# Altium project Archim_0.4.PrjPcb (part 2 of 3)

## Sheet EndStops.SchDoc: Endstops
size Letter; DocumentNumber: 7; SheetNumber: 4; SheetTotal: 11
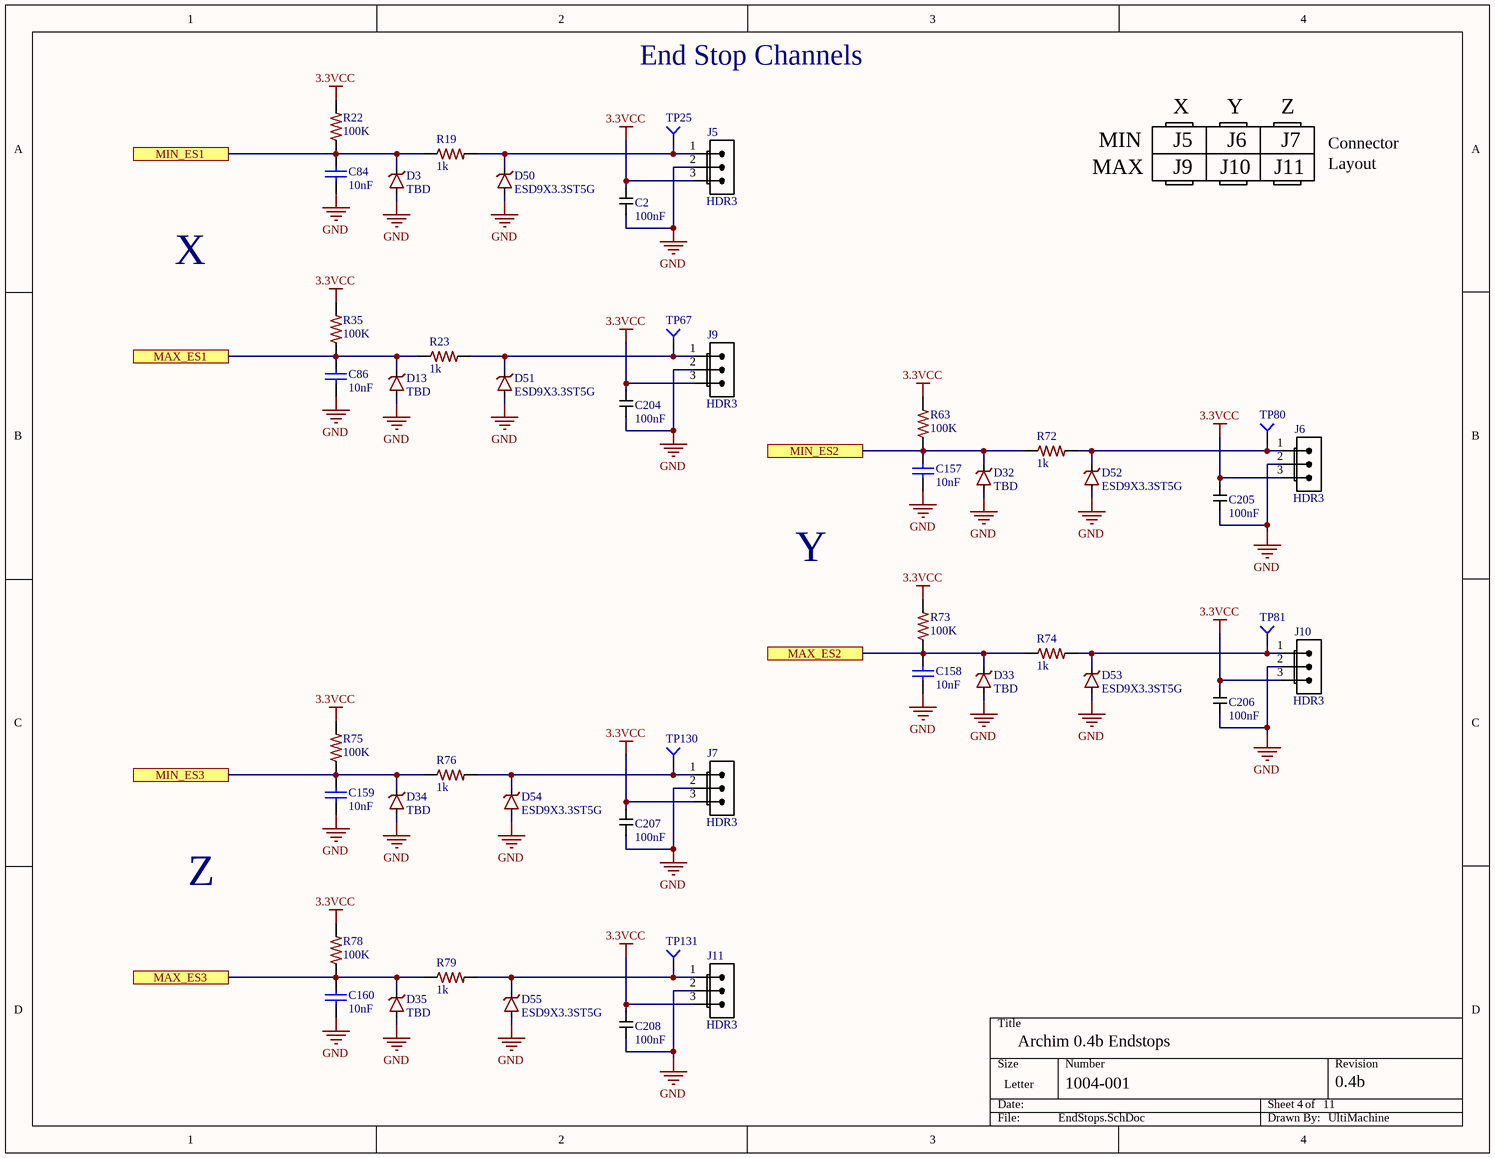
[diagram p3: EndStops.SchDoc]

### Parts
C2  100nF  [C0201 Large Pads]
C84  10nF  [C0402]
C86  10nF  [C0402]
C157  10nF  [C0402]
C158  10nF  [C0402]
C159  10nF  [C0402]
C160  10nF  [C0402]
C204  100nF  [C0201 Large Pads]
C205  100nF  [C0201 Large Pads]
C206  100nF  [C0201 Large Pads]
C207  100nF  [C0201 Large Pads]
C208  100nF  [C0201 Large Pads]
D3  TBD  [SOD923-D]
D13  TBD  [SOD923-D]
D32  TBD  [SOD923-D]
D33  TBD  [SOD923-D]
D34  TBD  [SOD923-D]
D35  TBD  [SOD923-D]
D50  ESD9X3.3ST5G  [SOD923-D]
D51  ESD9X3.3ST5G  [SOD923-D]
D52  ESD9X3.3ST5G  [SOD923-D]
D53  ESD9X3.3ST5G  [SOD923-D]
D54  ESD9X3.3ST5G  [SOD923-D]
D55  ESD9X3.3ST5G  [SOD923-D]
J5  value HDR3  [70543-02 PIN-IN-PASTE]  (hidden comment: Molex 70543-03)
J6  value HDR3  [70543-02 PIN-IN-PASTE]  (hidden comment: Molex 70543-03)
J7  value HDR3  [70543-02 PIN-IN-PASTE]  (hidden comment: Molex 70543-03)
J9  value HDR3  [70543-02 PIN-IN-PASTE]  (hidden comment: Molex 70543-03)
J10  value HDR3  [70543-02 PIN-IN-PASTE]  (hidden comment: Molex 70543-03)
J11  value HDR3  [70543-02 PIN-IN-PASTE]  (hidden comment: Molex 70543-03)
R19  1k  [R0402]
R22  100K  [R0402]
R23  1k  [R0402]
R35  100K  [R0402]
R63  100K  [R0402]
R72  1k  [R0402]
R73  100K  [R0402]
R74  1k  [R0402]
R75  100K  [R0402]
R76  1k  [R0402]
R78  100K  [R0402]
R79  1k  [R0402]
TP25  TP4  [TP-2]  (value not drawn)  (no BOM)
TP67  TP4  [TP-2]  (value not drawn)  (no BOM)
TP80  TP4  [TP-2]  (value not drawn)  (no BOM)
TP81  TP4  [TP-2]  (value not drawn)  (no BOM)
TP130  TP4  [TP-2]  (value not drawn)  (no BOM)
TP131  TP4  [TP-2]  (value not drawn)  (no BOM)

### Ports
MAX_ES1, MAX_ES2, MAX_ES3, MIN_ES1, MIN_ES2, MIN_ES3

### Nets
3.3VCC: C2.2 C204.2 C205.2 C206.2 C207.2 C208.2 J5.3(S) J6.3(S) J7.3(S) J9.3(S) J10.3(S) J11.3(S) R22.2 R35.2 R63.2 R73.2 R75.2 R78.2
GND: C2.1 C84.2 C86.2 C157.2 C158.2 C159.2 C160.2 C204.1 C205.1 C206.1 C207.1 C208.1 D3.A D13.A D32.A D33.A D34.A D35.A D50.A D51.A D52.A D53.A D54.A D55.A J5.2(S) J6.2(S) J7.2(S) J9.2(S) J10.2(S) J11.2(S)
MAX_ES1: C86.1 D13.K R23.1 R35.1 ; port MAX_ES1
MAX_ES2: C158.1 D33.K R73.1 R74.1 ; port MAX_ES2
MAX_ES3: C160.1 D35.K R78.1 R79.1 ; port MAX_ES3
MIN_ES1: C84.1 D3.K R19.1 R22.1 ; port MIN_ES1
MIN_ES2: C157.1 D32.K R63.1 R72.1 ; port MIN_ES2
MIN_ES3: C159.1 D34.K R75.1 R76.1 ; port MIN_ES3
NetD50_K: D50.K J5.1(S) R19.2 TP25.1
NetD51_K: D51.K J9.1(S) R23.2 TP67.1
NetD52_K: D52.K J6.1(S) R72.2 TP80.1
NetD53_K: D53.K J10.1(S) R74.2 TP81.1
NetD54_K: D54.K J7.1(S) R76.2 TP130.1
NetD55_K: D55.K J11.1(S) R79.2 TP131.1

### Notes on the sheet
- End Stop Channels
- MIN
- X
- J5
- Y
- J6
- Z
- J7
- Connector
- MAX
- J9
- J10
- J11
- Layout

### Library data of the parts
C2 C204-C208 = 100nF 6.3V X5R 0201: CAP CER 0.1UF 6.3V 10% X5R 0201; PART: .1uF; MANUFACTURER: Samsung; MANUFACTURER #: CL03A104KQ3NNNC; DISTRIBUTOR: DIGI-KEY; DISTRIBUTOR #: 1276-1013-1-ND; TOLERANCE: 10%; VOLTAGE: 6.3V
C84 C86 C157-C160 = GRM155R71H103JA88D: CAP CER 10nF 50V X7R 0402; PART DESCRIPTION: 10000pF ±5% 50V Ceramic Capacitor X7R 0402 (1005 Metric); MANUFACTURER: Murata; TOLERANCE: 5%; VALUE: 10nF; EE_SPEC: 50V; MANUFACTURER #: GRM155R71H103JA88D; DISTRIBUTOR #: 490-7763-1-ND; DISTRIBUTOR: Digi-Key Electronics; PART: 10nF 50V X7R 0402
D3 D13 D32-D35 = SOD923_TBD: MANUFACTURER #: TBD; VALUE: TBD; EE_SPEC: TBD
D50-D55 = ESD9X3.3ST5G: TVS DIODE 3.3VWM 10.4VC SOD923; MANUFACTURER: On Semi; PART DESCRIPTION: TVS DIODE 3.3VWM SOD923; TOLERANCE: -NA-; VALUE: 3.3V; EE_SPEC: 3.3Vso 15pF; MANUFACTURER #: ESD9X3.3ST5G; DISTRIBUTOR #: ESD9X3.3ST5GOSCT-ND; DISTRIBUTOR: Digikey
J5-J7 J9-J11 = CONN 3POS VERT 0.1" SHRD LOCKING PIP: 3 Positions Header, Shrouded Connector 0.100" (2.54mm) Through Hole Gold - Pin in Paste; MANUFACTURER #: 0705430002; PART: 3 Pin Conn VERT; TOLERANCE: -NA-; MANUFACTURER: Molex; DISTRIBUTOR #: WM4801-ND; DISTRIBUTOR: Digikey; PART DESCRIPTION: 3 Positions Header, Shrouded Connector 0.100" (2.54mm) Through Hole Gold; EE_SPEC: -NA-
R19 R23 R72 R74 R76 R79 = RK73H1ETTP1001F: RES 0402 1k 63mW 1%; MANUFACTURER: Yageo; MANUFACTURER #: RC0402FR-071KL; PART: 1k 1% 0402; PART DESCRIPTION: 1k Ohm ±1% 0.063W, 1/16W Chip Resistor 0402 (1005 Metric) Moisture Resistant Thick Film; EE_SPEC: 1/16W; VALUE: 1k; DISTRIBUTOR #: 311-1.00KLRTR-ND; DISTRIBUTOR: Digi-Key Electronics; TOLERANCE: 1%
R22 R35 R63 R73 R75 R78 = RC1005F104CS: RES SMD 100K OHM 1% 1/16W 0402; MANUFACTURER: Samsung; PART: 100k 1% 0402; PART DESCRIPTION: 100k Ohm ±1% 0.063W, 1/16W Chip Resistor 0402 (1005 Metric) Moisture Resistant Thick Film; VALUE: 100K; MANUFACTURER #: RC1005F104CS; DISTRIBUTOR #: 1276-3432-1-ND; DISTRIBUTOR: Digi-Key Electronics; TOLERANCE: 1%; EE_SPEC: 1/16W
TP25 TP67 TP80 TP81 TP130 TP131 = Socket: MANUFACTURER #: NOTAPART-Testpoint

## Sheet Motor-X.SchDoc: Motor-X
size Letter; DocumentNumber: 3; SheetNumber: 5; SheetTotal: 11
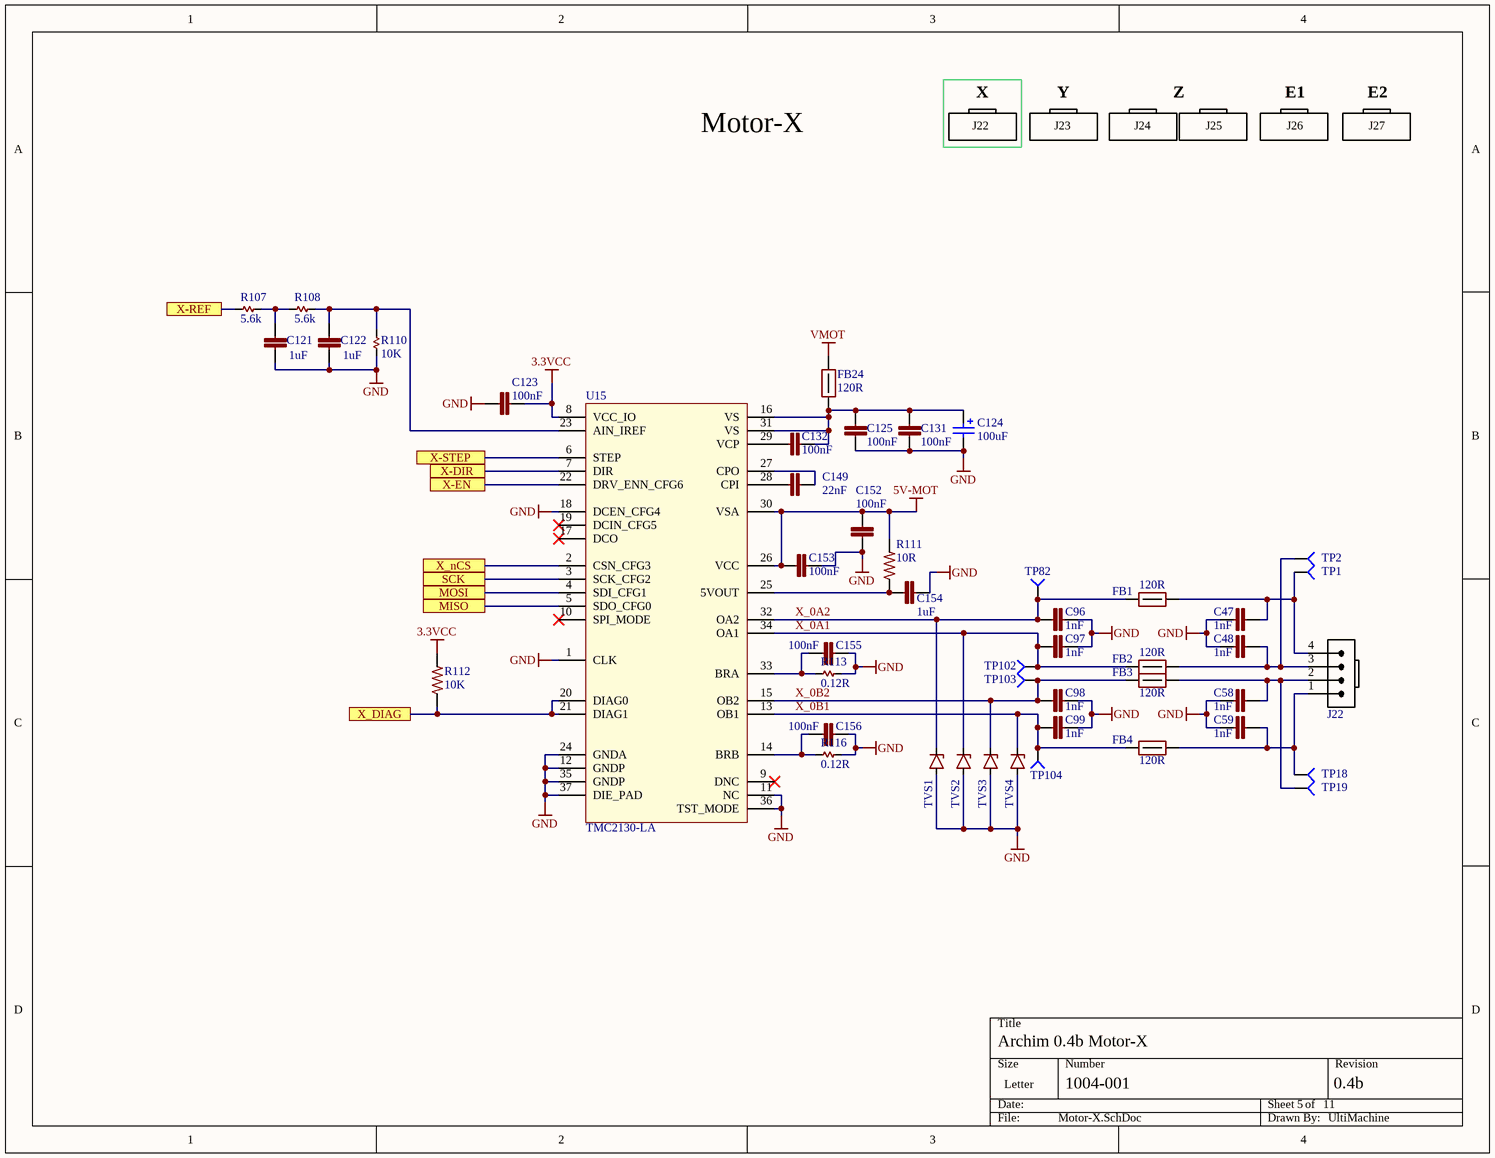
[diagram p4: Motor-X.SchDoc]

### Parts
C47  1nF  [C0402]
C48  1nF  [C0402]
C58  1nF  [C0402]
C59  1nF  [C0402]
C96  1nF  [C0402]
C97  1nF  [C0402]
C98  1nF  [C0402]
C99  1nF  [C0402]
C121  1uF  [C0402]
C122  1uF  [C0402]
C123  100nF  [C0402]
C124  value 100uF  [CAP-ELEC-063063077]  (hidden comment: UWT1V101MCL1GS)
C125  100nF  [C0603]
C131  100nF  [C0603]
C132  100nF  [C0603]
C149  22nF  [C0402]
C152  100nF  [C0402]
C153  100nF  [C0402]
C154  1uF  [C0402]
C155  100nF  [C0603]
C156  100nF  [C0603]
FB1  120R  [FB0603]
FB2  120R  [FB0603]
FB3  120R  [FB0603]
FB4  120R  [FB0603]
FB24  120R  [FB0603]
J22  Molex 0705430038  [4POL254 PIN-IN-PASTE]  (value not drawn)
R107  5.6k  [R0402]
R108  5.6k  [R0402]
R110  10K  [R0402]
R111  10R  [R0402]
R112  10K  [R0402]
R113  0.12R  [R1206]
R116  0.12R  [R1206]
TP1  TP4  [TP-2]  (value not drawn)  (no BOM)
TP2  TP4  [TP-2]  (value not drawn)  (no BOM)
TP18  TP4  [TP-2]  (value not drawn)  (no BOM)
TP19  TP4  [TP-2]  (value not drawn)  (no BOM)
TP82  TP4  [TP-2]  (value not drawn)  (no BOM)
TP102  TP4  [TP-2]  (value not drawn)  (no BOM)
TP103  TP4  [TP-2]  (value not drawn)  (no BOM)
TP104  TP4  [TP-2]  (value not drawn)  (no BOM)
TVS1  TVS 30V SMF  [SMF]  (value not drawn)
TVS2  TVS 30V SMF  [SMF]  (value not drawn)
TVS3  TVS 30V SMF  [SMF]  (value not drawn)
TVS4  TVS 30V SMF  [SMF]  (value not drawn)
U15  TMC2130-LA  [QFN36-50P500X600X900_HS-37N]

### Ports
MISO, MOSI, SCK, X-DIR, X-EN, X-REF, X-STEP, X_DIAG, X_nCS

### Nets
3.3VCC: C123.1 R112.2 U15.8(VCC_IO)
5V-MOT: C152.2 C153.2 R111.2 U15.26(VCC) U15.30(VSA)
GND: C47.1 C48.1 C58.1 C59.1 C96.2 C97.2 C98.2 C99.2 C121.2 C122.2 C123.2 C124.2 C125.1 C131.1 C152.1 C153.1 C154.2 C155.1 C156.1 R110.1 R113.2 R116.2 TVS1.A TVS2.A TVS3.A TVS4.A U15.1(CLK) U15.11(NC) U15.12(GNDP) U15.18(DCEN_CFG4) U15.24(GNDA) U15.35(GNDP) U15.36(TST_MODE) U15.37(DIE_PAD)
VMOT: FB24.2
MISO: U15.5(SDO_CFG0) ; port MISO
MOSI: U15.4(SDI_CFG1) ; port MOSI
SCK: U15.3(SCK_CFG2) ; port SCK
X-DIR: U15.7(DIR) ; port X-DIR
X-EN: U15.22(DRV_ENN_CFG6) ; port X-EN
X-REF: R107.1 ; port X-REF
X-STEP: U15.6(STEP) ; port X-STEP
X_0A1: C97.1 FB2.1 TP102.1 TVS2.K U15.34(OA1)
X_0A2: C96.1 FB1.1 TP82.1 TVS1.K U15.32(OA2)
X_0B1: C99.1 FB4.1 TP104.1 TVS4.K U15.13(OB1)
X_0B2: C98.1 FB3.1 TP103.1 TVS3.K U15.15(OB2)
X_DIAG: R112.1 U15.20(DIAG0) U15.21(DIAG1) ; port X_DIAG
X_nCS: U15.2(CSN_CFG3) ; port X_nCS
NetC47_2: C47.2 FB1.2 J22.4 TP1.1
NetC48_2: C48.2 FB2.2 J22.3 TP2.1
NetC58_2: C58.2 FB3.2 J22.2 TP19.1
NetC59_2: C59.2 FB4.2 J22.1 TP18.1
NetC121_1: C121.1 R107.2 R108.1
NetC122_1: C122.1 R108.2 R110.2 U15.23(AIN_IREF)
NetC124_1: C124.1 C125.2 C131.2 C132.2 FB24.1 U15.16(VS) U15.31(VS)
NetC132_1: C132.1 U15.29(VCP)
NetC149_1: C149.1 U15.28(CPI)
NetC149_2: C149.2 U15.27(CPO)
NetC154_1: C154.1 R111.1 U15.25(5VOUT)
NetC155_2: C155.2 R113.1 U15.33(BRA)
NetC156_2: C156.2 R116.1 U15.14(BRB)

Not connected (* = marked no-connect by the designer): U15 9(DNC)* 10(SPI_MODE)* 17(DCO)* 19(DCIN_CFG5)*

### Notes on the sheet
- X
- Y
- Z
- E1
- E2
- Motor-X
- J22
- J23
- J24
- J25
- J26
- J27

### Library data of the parts
C47 C48 C58 C59 C96-C99 = CAP 1nF 50V 0402 X7R: as C13 on sheet Power; VALUE: 1nF; DISTRIBUTOR #: 490-1303-2-ND; DISTRIBUTOR: Digi-Key Electronics; EE_SPEC: 50V
C121 C122 = GRM155R60J105KE19D: as C24 on sheet Power; VALUE: 1uF; MANUFACTURER #: GRM155R60J105KE19D; DISTRIBUTOR #: 490-1320-2-ND; DISTRIBUTOR: Digi-Key Electronics; TOLERANCE: 10%; EE_SPEC: 1uF 6.3V X5R 0402
C123 C152 C153 = GRM155R71C104KA88D: CAP CER 0402 100nF 16V 10% X7R; Manufacturer: Murata; PART: 0.1uF 16V X7R 0402; Part Description: 0.10µF ±10% 16V Ceramic Capacitor X7R 0402 (1005 Metric); EE_SPEC: 100nF 16V X7R 0402; VALUE: 100nF; MANUFACTURER #: GRM155R71C104KA88D; DISTRIBUTOR #: 490-3261-2-ND; DISTRIBUTOR: Digi-Key Electronics; Tolerance: 10%
C124 = UWT1V101MCL1GS: CAP ALUM 100UF 35V 20% SMD; Manufacturer: Nichicon; PART: 100uF 35V SMD Al-El; Part Description: 100µF 35V Aluminum Capacitors Radial, Can - SMD 1000 Hrs @ 105°C; EE_SPEC: 100uF 35V Al-El; MANUFACTURER #: UWT1V101MCL1GS; DISTRIBUTOR #: 493-2203-2-ND; DISTRIBUTOR: Digi-Key Electronics; Tolerance: 20%
C125 C131 C132 C155 C156 = C0603C104K5RACTU: as C199 on sheet Power; VALUE: 100nF; MANUFACTURER #: C0603C104K5RACTU; DISTRIBUTOR #: 399-5089-2-ND; DISTRIBUTOR: Digi-Key Electronics; PART: 100nF 50V X7R 0603; Tolerance: 10%
C149 = GCM155R71H223KA55D: CAP CER 0402 22nF ±10% 50V X7R; Manufacturer: YAGEO; Part Description: 0.022µF ±10% 50V Ceramic Capacitor X7R 0402 (1005 Metric); EE_SPEC: 22nF 50V X7R 0402; Tolerance: +/- 10%; VALUE: 22nF; MANUFACTURER #: GCM155R71H223KA55D; DISTRIBUTOR #: 490-4763-2-ND; DISTRIBUTOR: Digi-Key Electronics; PART: 22nF
C154 = GRM155R60J105KE19D: CAP CER 0402 1uF 6.3V 10% X5R; Manufacturer: Murata; Part Description: 1µF ±10% 6.3V Ceramic Capacitor X5R 0402 (1005 Metric); EE_SPEC: 1uF 6.3V X5R 0402; VALUE: 1uF; MANUFACTURER #: GRM155R60J105KE19D; DISTRIBUTOR #: 490-1320-2-ND; DISTRIBUTOR: Digi-Key Electronics; PART: 1uF 6.3V X5R 0402; Tolerance: 10%
FB1-FB4 = FERRITE 120R 3A 0603: as FB26 on sheet Microcontroller; DISTRIBUTOR #: 1276-6351-2-ND; DISTRIBUTOR: Digi-Key Electronics; PART: FERRITE 120R 3A 0603; PART DESCRIPTION: FERRITE BEAD 120 OHM 0603 1LN
FB24 = FERRITE 120R 3A 0603: FERRITE BEAD 120 OHM 0603 1LN; MANUFACTURER: Samsung; MANUFACTURER #: CIS10P121AC; VALUE: 120Rfb; TOLERANCE: -NA-; EE_SPEC: 3A; DISTRIBUTOR #: 1276-6351-2-ND; DISTRIBUTOR: Digi-Key Electronics; PART: FERRITE 120R 3A 0603; PART DESCRIPTION: FERRITE BEAD 120 OHM 0603 1LN
J22 = Molex 0705430003 PIP: as J21 on sheet Power
R107 R108 = 5.6k 1% 0402: RES SMD 5.6K OHM 1% 1/16W 0402; MANUFACTURER: YAGEO; MANUFACTURER #: RC0402FR-075K6L; PART DESCRIPTION: ±1% 0.063W, 1/16W Chip Resistor 0402 (1005 Metric) Moisture Resistant Thick Film; DISTRIBUTOR #: 311-5.6KLRTR-ND; DISTRIBUTOR: Digi-Key Electronics; PART: RES SMD 5.6K OHM 1% 1/16W 0402; TOLERANCE: 1%; EE_SPEC: 1/16W; VALUE: 5.6k
R110 = 10k 1% 0402: as R11 on sheet Power; DISTRIBUTOR #: YAG1249TR-ND; DISTRIBUTOR: Digi-Key Electronics; PART: 10k 1% 0402; TOLERANCE: 1%; EE_SPEC: 1/16W; VALUE: 10K
R111 = RC0402FR-0710RL: RES SMD 10 OHM 1% 1/16W 0402; Manufacturer: Yageo; Part Description: 10 Ohm ±1% 0.063W, 1/16W Chip Resistor 0402 (1005 Metric) Moisture Resistant Thick Film; EE_SPEC: 10R 1% 0402; VALUE: 10R; MANUFACTURER #: RC0402FR-0710RL; DISTRIBUTOR #: 311-10.0LRTR-ND; DISTRIBUTOR: Digi-Key Electronics; PART: 10R; Tolerance: 1%
R112 = RC0402FR-0710KP: as R64 on sheet Microcontroller; VALUE: 10K; MANUFACTURER #: RC0402FR-0710KP; DISTRIBUTOR #: YAG1249TR-ND; DISTRIBUTOR: Digi-Key Electronics; TOLERANCE: 1%; EE_SPEC: 1/16W
R113 R116 = 0.12R 1% 1206: RES 0.12 OHM 1% 1/2W 1206; MANUFACTURER #: RL1206FR-7W0R12L; Part Description: 120 mOhms ±1% 0.5W, 1/2W Chip Resistor 1206 (3216 Metric) Automotive AEC-Q200, Current Sense, Moisture Resistant Thick Film; Tolerance: +/- 1%; DISTRIBUTOR #: 311-.12LYTR-ND; DISTRIBUTOR: Digi-Key; EE_SPEC: 0.12R 1% 1206; PART: 0.12R; VALUE: 0.12R
TP1 TP2 TP18 TP19 TP82 TP102-TP104 = Socket: MANUFACTURER #: NOTAPART-Testpoint
TVS1-TVS4 = TVS 30V SMF: TVS DIODE 30VWM 48.4VC SMF; MANUFACTURER: Vishay; MANUFACTURER #: SMF30A-E3-08; PART: TVS Diode 48.4VC; TOLERANCE: -NA-; EE_SPEC: 30Vrs 48.4Vc; DISTRIBUTOR #: SMF30A-E3-08GITR-ND; DISTRIBUTOR: Digi-Key Electronics; PART DESCRIPTION: TVS DIODE 30VWM 48.4VC SMF
U15 = TMC2130-LA-T: IC STEPPER MOTOR DVR SPI 36QFN; Manufacturer: Trinamic; Part Description: Bipolar Motor Driver Power MOSFET SPI, Step/Direction 36-QFN (5x6); EE_SPEC: 46V 1.2A 1/256 Step; Tolerance: NA; DISTRIBUTOR #: 1460-1130-2-ND; DISTRIBUTOR: Digi-Key Electronics; MANUFACTURER #: TMC2130-LA-T; PART: TMC2130; VALUE: TMC2130

## Sheet Motor-Y.SchDoc: Motor-Y
size Letter; DocumentNumber: 3; SheetNumber: 6; SheetTotal: 11
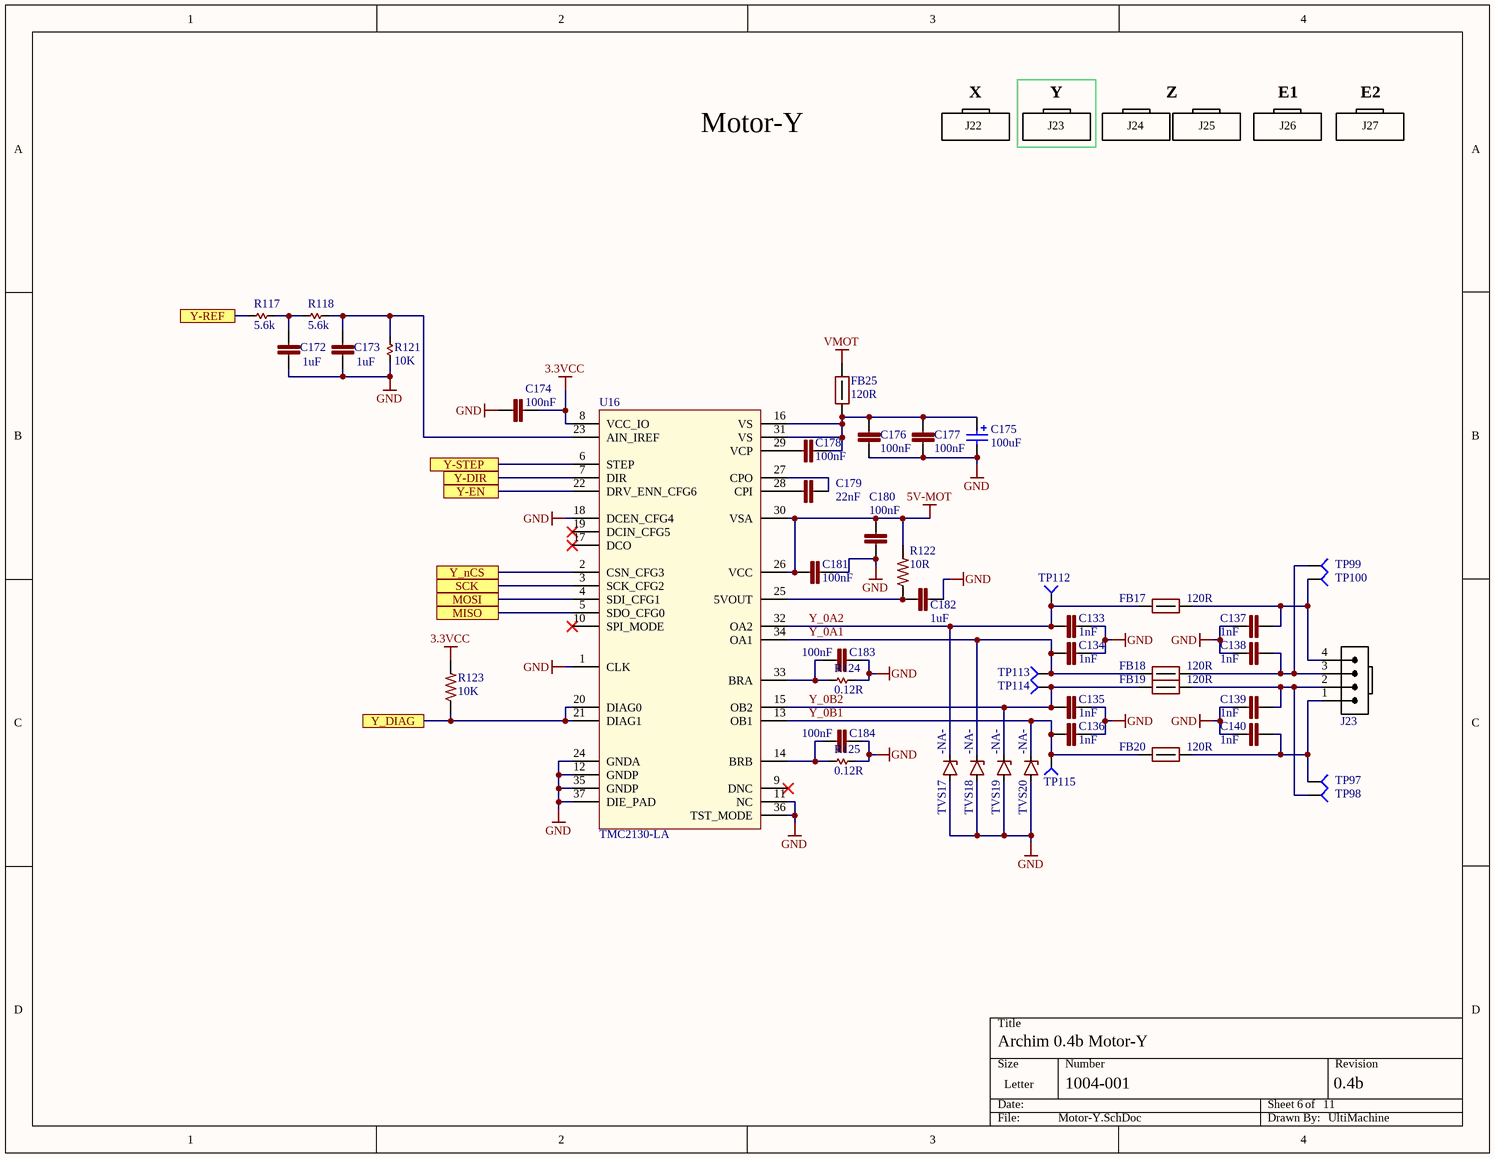
[diagram p5: Motor-Y.SchDoc]

### Parts
C133  1nF  [C0402]
C134  1nF  [C0402]
C135  1nF  [C0402]
C136  1nF  [C0402]
C137  1nF  [C0402]
C138  1nF  [C0402]
C139  1nF  [C0402]
C140  1nF  [C0402]
C172  1uF  [C0402]
C173  1uF  [C0402]
C174  100nF  [C0402]
C175  value 100uF  [CAP-ELEC-063063077]  (hidden comment: UWT1V101MCL1GS)
C176  100nF  [C0603]
C177  100nF  [C0603]
C178  100nF  [C0603]
C179  22nF  [C0402]
C180  100nF  [C0402]
C181  100nF  [C0402]
C182  1uF  [C0402]
C183  100nF  [C0603]
C184  100nF  [C0603]
FB17  120R  [FB0603]
FB18  120R  [FB0603]
FB19  120R  [FB0603]
FB20  120R  [FB0603]
FB25  120R  [FB0603]
J23  Molex 0705430038  [4POL254 PIN-IN-PASTE]  (value not drawn)
R117  5.6k  [R0402]
R118  5.6k  [R0402]
R121  10K  [R0402]
R122  10R  [R0402]
R123  10K  [R0402]
R124  0.12R  [R1206]
R125  0.12R  [R1206]
TP97  TP4  [TP-2]  (value not drawn)  (no BOM)
TP98  TP4  [TP-2]  (value not drawn)  (no BOM)
TP99  TP4  [TP-2]  (value not drawn)  (no BOM)
TP100  TP4  [TP-2]  (value not drawn)  (no BOM)
TP112  TP4  [TP-2]  (value not drawn)  (no BOM)
TP113  TP4  [TP-2]  (value not drawn)  (no BOM)
TP114  TP4  [TP-2]  (value not drawn)  (no BOM)
TP115  TP4  [TP-2]  (value not drawn)  (no BOM)
TVS17  value -NA-  [SMF]  (hidden comment: TVS 30V SMF)
TVS18  value -NA-  [SMF]  (hidden comment: TVS 30V SMF)
TVS19  value -NA-  [SMF]  (hidden comment: TVS 30V SMF)
TVS20  value -NA-  [SMF]  (hidden comment: TVS 30V SMF)
U16  TMC2130-LA  [QFN36-50P500X600X900_HS-37N]

### Ports
MISO, MOSI, SCK, Y-DIR, Y-EN, Y-REF, Y-STEP, Y_DIAG, Y_nCS

### Nets
3.3VCC: C174.1 R123.2 U16.8(VCC_IO)
5V-MOT: C180.2 C181.2 R122.2 U16.26(VCC) U16.30(VSA)
GND: C133.2 C134.2 C135.2 C136.2 C137.2 C138.2 C139.2 C140.2 C172.2 C173.2 C174.2 C175.2 C176.1 C177.1 C180.1 C181.1 C182.2 C183.1 C184.1 R121.1 R124.2 R125.2 TVS17.A TVS18.A TVS19.A TVS20.A U16.1(CLK) U16.11(NC) U16.12(GNDP) U16.18(DCEN_CFG4) U16.24(GNDA) U16.35(GNDP) U16.36(TST_MODE) U16.37(DIE_PAD)
VMOT: FB25.2
MISO: U16.5(SDO_CFG0) ; port MISO
MOSI: U16.4(SDI_CFG1) ; port MOSI
SCK: U16.3(SCK_CFG2) ; port SCK
Y-DIR: U16.7(DIR) ; port Y-DIR
Y-EN: U16.22(DRV_ENN_CFG6) ; port Y-EN
Y-REF: R117.1 ; port Y-REF
Y-STEP: U16.6(STEP) ; port Y-STEP
Y_0A1: C134.1 FB18.1 TP113.1 TVS18.K U16.34(OA1)
Y_0A2: C133.1 FB17.1 TP112.1 TVS17.K U16.32(OA2)
Y_0B1: C136.1 FB20.1 TP115.1 TVS20.K U16.13(OB1)
Y_0B2: C135.1 FB19.1 TP114.1 TVS19.K U16.15(OB2)
Y_DIAG: R123.1 U16.20(DIAG0) U16.21(DIAG1) ; port Y_DIAG
Y_nCS: U16.2(CSN_CFG3) ; port Y_nCS
NetC137_1: C137.1 FB17.2 J23.4 TP100.1
NetC138_1: C138.1 FB18.2 J23.3 TP99.1
NetC139_1: C139.1 FB19.2 J23.2 TP98.1
NetC140_1: C140.1 FB20.2 J23.1 TP97.1
NetC172_1: C172.1 R117.2 R118.1
NetC173_1: C173.1 R118.2 R121.2 U16.23(AIN_IREF)
NetC175_1: C175.1 C176.2 C177.2 C178.2 FB25.1 U16.16(VS) U16.31(VS)
NetC178_1: C178.1 U16.29(VCP)
NetC179_1: C179.1 U16.28(CPI)
NetC179_2: C179.2 U16.27(CPO)
NetC182_1: C182.1 R122.1 U16.25(5VOUT)
NetC183_2: C183.2 R124.1 U16.33(BRA)
NetC184_2: C184.2 R125.1 U16.14(BRB)

Not connected (* = marked no-connect by the designer): U16 9(DNC)* 10(SPI_MODE)* 17(DCO)* 19(DCIN_CFG5)*

### Notes on the sheet
- X
- Y
- Z
- E1
- E2
- Motor-Y
- J22
- J23
- J24
- J25
- J26
- J27

### Library data of the parts
C133-C140 = CAP 1nF 50V 0402 X7R: 1000pF 50V Ceramic Capacitor X7R 0402 (1005 Metric) 0.039" L x 0.020" W (1.00mm x 0.50mm); MANUFACTURER: Murata; MANUFACTURER #: GRM155R71H102KA01D; PART: 1nF 50V X7R 0402; PART DESCRIPTION: 1000pF ±10% 50V Ceramic Capacitor X7R 0402 (1005 Metric); TOLERANCE: 10%; VALUE: 1nF; DISTRIBUTOR #: 490-1303-2-ND; DISTRIBUTOR: Digi-Key Electronics; EE_SPEC: 50V
C172 C173 = GRM155R60J105KE19D: CAP CER 0402 1uF 6.3V 10% X5R; MANUFACTURER: Murata; PART: 1uF 6.3V X5R 0402; PART DESCRIPTION: 1µF ±10% 6.3V Ceramic Capacitor X5R 0402 (1005 Metric); VALUE: 1uF; MANUFACTURER #: GRM155R60J105KE19D; DISTRIBUTOR #: 490-1320-2-ND; DISTRIBUTOR: Digi-Key Electronics; TOLERANCE: 10%; EE_SPEC: 1uF 6.3V X5R 0402
C174 C180 C181 = GRM155R71C104KA88D: CAP CER 0402 100nF 16V 10% X7R; Manufacturer: Murata; PART: 0.1uF 16V X7R 0402; Part Description: 0.10µF ±10% 16V Ceramic Capacitor X7R 0402 (1005 Metric); EE_SPEC: 100nF 16V X7R 0402; VALUE: 100nF; MANUFACTURER #: GRM155R71C104KA88D; DISTRIBUTOR #: 490-3261-2-ND; DISTRIBUTOR: Digi-Key Electronics; Tolerance: 10%
C175 = UWT1V101MCL1GS: CAP ALUM 100UF 35V 20% SMD; Manufacturer: Nichicon; PART: 100uF 35V SMD Al-El; Part Description: 100µF 35V Aluminum Capacitors Radial, Can - SMD 1000 Hrs @ 105°C; EE_SPEC: 100uF 35V Al-El; MANUFACTURER #: UWT1V101MCL1GS; DISTRIBUTOR #: 493-2203-2-ND; DISTRIBUTOR: Digi-Key Electronics; Tolerance: 20%
C176-C178 C183 C184 = C0603C104K5RACTU: CAP CER 0603 100nF 50V 10% X7R; Manufacturer: Kemet; Part Description: 0.1µF ±10% 50V Ceramic Capacitor X7R 0603 (1608 Metric); EE_SPEC: 100nF 50V X7R 0603; VALUE: 100nF; MANUFACTURER #: C0603C104K5RACTU; DISTRIBUTOR #: 399-5089-2-ND; DISTRIBUTOR: Digi-Key Electronics; PART: 100nF 50V X7R 0603; Tolerance: 10%
C179 = GCM155R71H223KA55D: CAP CER 0402 22nF ±10% 50V X7R; Manufacturer: YAGEO; Part Description: 0.022µF ±10% 50V Ceramic Capacitor X7R 0402 (1005 Metric); EE_SPEC: 22nF 50V X7R 0402; Tolerance: +/- 10%; VALUE: 22nF; MANUFACTURER #: GCM155R71H223KA55D; DISTRIBUTOR #: 490-4763-2-ND; DISTRIBUTOR: Digi-Key Electronics; PART: 22nF
C182 = GRM155R60J105KE19D: CAP CER 0402 1uF 6.3V 10% X5R; Manufacturer: Murata; Part Description: 1µF ±10% 6.3V Ceramic Capacitor X5R 0402 (1005 Metric); EE_SPEC: 1uF 6.3V X5R 0402; VALUE: 1uF; MANUFACTURER #: GRM155R60J105KE19D; DISTRIBUTOR #: 490-1320-2-ND; DISTRIBUTOR: Digi-Key Electronics; PART: 1uF 6.3V X5R 0402; Tolerance: 10%
FB17-FB20 = FERRITE 120R 3A 0603: FERRITE BEAD 120 OHM 0603 1LN; MANUFACTURER: Samsung; MANUFACTURER #: CIS10P121AC; MANUFACTURER2#: 490-5254-2-ND; VALUE: 120Rfb; TOLERANCE: -NA-; EE_SPEC: 3A; DISTRIBUTOR #: 1276-6351-2-ND; DISTRIBUTOR: Digi-Key Electronics; PART: FERRITE 120R 3A 0603; PART DESCRIPTION: FERRITE BEAD 120 OHM 0603 1LN
FB25 = FERRITE 120R 3A 0603: FERRITE BEAD 120 OHM 0603 1LN; MANUFACTURER: Samsung; MANUFACTURER #: CIS10P121AC; VALUE: 120Rfb; TOLERANCE: -NA-; EE_SPEC: 3A; DISTRIBUTOR #: 1276-6351-2-ND; DISTRIBUTOR: Digi-Key Electronics; PART: FERRITE 120R 3A 0603; PART DESCRIPTION: FERRITE BEAD 120 OHM 0603 1LN
J23 = Molex 0705430003 PIP: Molex 4 Pin Clip Connector - Pin In Paste footprint
R117 R118 = 5.6k 1% 0402: RES SMD 5.6K OHM 1% 1/16W 0402; MANUFACTURER: YAGEO; MANUFACTURER #: RC0402FR-075K6L; PART DESCRIPTION: ±1% 0.063W, 1/16W Chip Resistor 0402 (1005 Metric) Moisture Resistant Thick Film; DISTRIBUTOR #: 311-5.6KLRTR-ND; DISTRIBUTOR: Digi-Key Electronics; PART: RES SMD 5.6K OHM 1% 1/16W 0402; TOLERANCE: 1%; EE_SPEC: 1/16W; VALUE: 5.6k
R121 = 10k 1% 0402: RES SMD 10K OHM 1% 1/16W 0402; MANUFACTURER: Yageo; MANUFACTURER #: RC0402FR-0710KP; PART DESCRIPTION: 10k Ohm ±1% 0.063W, 1/16W Chip Resistor 0402 (1005 Metric) Moisture Resistant Thick Film; DISTRIBUTOR #: YAG1249TR-ND; DISTRIBUTOR: Digi-Key Electronics; PART: 10k 1% 0402; TOLERANCE: 1%; EE_SPEC: 1/16W; VALUE: 10K
R122 = RC0402FR-0710RL: RES SMD 10 OHM 1% 1/16W 0402; Manufacturer: Yageo; Part Description: 10 Ohm ±1% 0.063W, 1/16W Chip Resistor 0402 (1005 Metric) Moisture Resistant Thick Film; EE_SPEC: 10R 1% 0402; VALUE: 10R; MANUFACTURER #: RC0402FR-0710RL; DISTRIBUTOR #: 311-10.0LRTR-ND; DISTRIBUTOR: Digi-Key Electronics; PART: 10R; Tolerance: 1%
R123 = RC0402FR-0710KP: RES SMD 10K OHM 1% 1/16W 0402; MANUFACTURER: Yageo; PART: 10k 1% 0402; PART DESCRIPTION: 10k Ohm ±1% 0.063W, 1/16W Chip Resistor 0402 (1005 Metric) Moisture Resistant Thick Film; VALUE: 10K; MANUFACTURER #: RC0402FR-0710KP; DISTRIBUTOR #: YAG1249TR-ND; DISTRIBUTOR: Digi-Key Electronics; TOLERANCE: 1%; EE_SPEC: 1/16W
R124 R125 = 0.12R 1% 1206: RES 0.12 OHM 1% 1/2W 1206; MANUFACTURER #: RL1206FR-7W0R12L; Part Description: 120 mOhms ±1% 0.5W, 1/2W Chip Resistor 1206 (3216 Metric) Automotive AEC-Q200, Current Sense, Moisture Resistant Thick Film; Tolerance: +/- 1%; DISTRIBUTOR #: 311-.12LYTR-ND; DISTRIBUTOR: Digi-Key; EE_SPEC: 0.12R 1% 1206; PART: 0.12R; VALUE: 0.12R
TP97-TP100 TP112-TP115 = Socket: MANUFACTURER #: NOTAPART-Testpoint
TVS17-TVS20 = TVS 30V SMF: TVS DIODE 30VWM 48.4VC SMF; MANUFACTURER: Vishay; MANUFACTURER #: SMF30A-E3-08; PART: TVS Diode 48.4VC; EE_SPEC: 30Vrs 48.4Vc; DISTRIBUTOR #: SMF30A-E3-08GITR-ND; DISTRIBUTOR: Digi-Key Electronics; PART DESCRIPTION: TVS DIODE 30VWM 48.4VC SMF; TOLERANCE: -NA-
U16 = TMC2130-LA-T: IC STEPPER MOTOR DVR SPI 36QFN; Manufacturer: Trinamic; Part Description: Bipolar Motor Driver Power MOSFET SPI, Step/Direction 36-QFN (5x6); EE_SPEC: 46V 1.2A 1/256 Step; Tolerance: NA; DISTRIBUTOR #: 1460-1130-2-ND; DISTRIBUTOR: Digi-Key Electronics; MANUFACTURER #: TMC2130-LA-T; PART: TMC2130; VALUE: TMC2130

## Sheet Motor-Z.SchDoc: Motor-Z
size Letter; DocumentNumber: 4; SheetNumber: 7; SheetTotal: 11
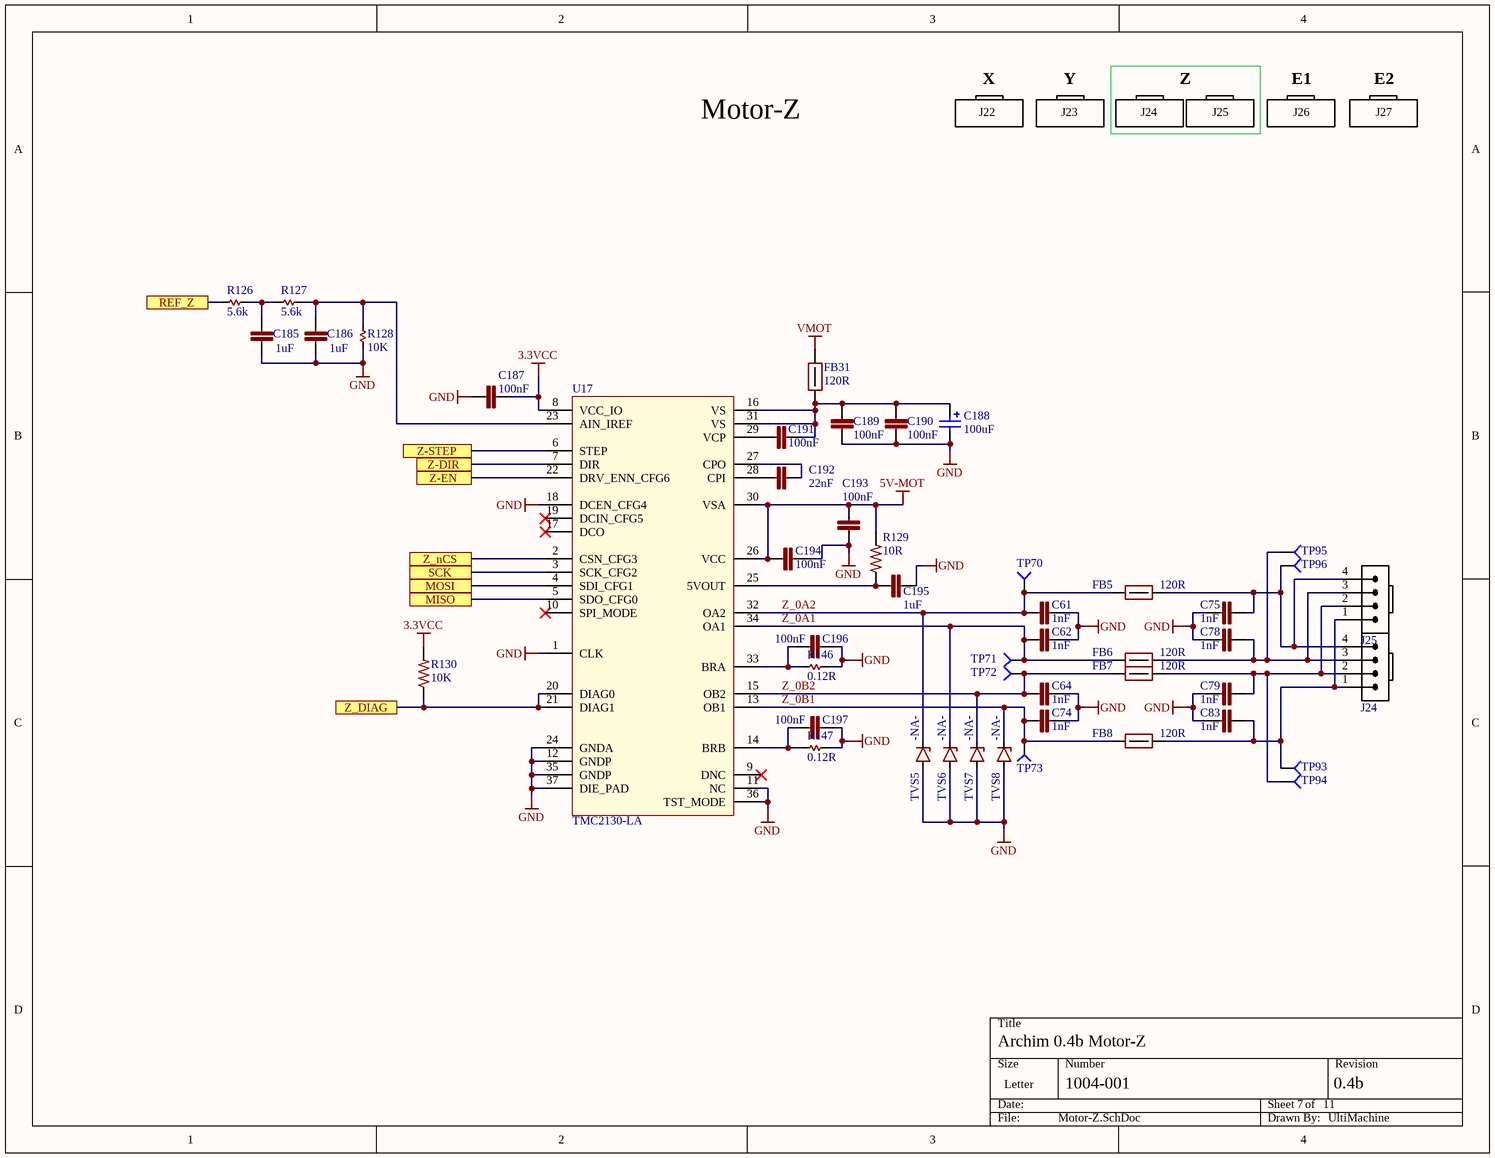
[diagram p6: Motor-Z.SchDoc]

### Parts
C61  1nF  [C0402]
C62  1nF  [C0402]
C64  1nF  [C0402]
C74  1nF  [C0402]
C75  1nF  [C0402]
C78  1nF  [C0402]
C79  1nF  [C0402]
C83  1nF  [C0402]
C185  1uF  [C0402]
C186  1uF  [C0402]
C187  100nF  [C0402]
C188  value 100uF  [CAP-ELEC-063063077]  (hidden comment: UWT1V101MCL1GS)
C189  100nF  [C0603]
C190  100nF  [C0603]
C191  100nF  [C0603]
C192  22nF  [C0402]
C193  100nF  [C0402]
C194  100nF  [C0402]
C195  1uF  [C0402]
C196  100nF  [C0603]
C197  100nF  [C0603]
FB5  120R  [FB0603]
FB6  120R  [FB0603]
FB7  120R  [FB0603]
FB8  120R  [FB0603]
FB31  120R  [FB0603]
J24  Molex 0705430038  [4POL254 PIN-IN-PASTE]  (value not drawn)
J25  Molex 0705430038  [4POL254 PIN-IN-PASTE]  (value not drawn)
R126  5.6k  [R0402]
R127  5.6k  [R0402]
R128  10K  [R0402]
R129  10R  [R0402]
R130  10K  [R0402]
R146  0.12R  [R1206]
R147  0.12R  [R1206]
TP70  TP4  [TP-2]  (value not drawn)  (no BOM)
TP71  TP4  [TP-2]  (value not drawn)  (no BOM)
TP72  TP4  [TP-2]  (value not drawn)  (no BOM)
TP73  TP4  [TP-2]  (value not drawn)  (no BOM)
TP93  TP4  [TP-2]  (value not drawn)  (no BOM)
TP94  TP4  [TP-2]  (value not drawn)  (no BOM)
TP95  TP4  [TP-2]  (value not drawn)  (no BOM)
TP96  TP4  [TP-2]  (value not drawn)  (no BOM)
TVS5  value -NA-  [SMF]  (hidden comment: TVS 30V SMF)
TVS6  value -NA-  [SMF]  (hidden comment: TVS 30V SMF)
TVS7  value -NA-  [SMF]  (hidden comment: TVS 30V SMF)
TVS8  value -NA-  [SMF]  (hidden comment: TVS 30V SMF)
U17  TMC2130-LA  [QFN36-50P500X600X900_HS-37N]

### Ports
MISO, MOSI, REF_Z, SCK, Z-DIR, Z-EN, Z-STEP, Z_DIAG, Z_nCS

### Nets
3.3VCC: C187.1 R130.2 U17.8(VCC_IO)
5V-MOT: C193.2 C194.2 R129.2 U17.26(VCC) U17.30(VSA)
GND: C61.2 C62.2 C64.2 C74.2 C75.1 C78.1 C79.1 C83.1 C185.2 C186.2 C187.2 C188.2 C189.1 C190.1 C193.1 C194.1 C195.2 C196.1 C197.1 R128.1 R146.2 R147.2 TVS5.A TVS6.A TVS7.A TVS8.A U17.1(CLK) U17.11(NC) U17.12(GNDP) U17.18(DCEN_CFG4) U17.24(GNDA) U17.35(GNDP) U17.36(TST_MODE) U17.37(DIE_PAD)
VMOT: FB31.2
MISO: U17.5(SDO_CFG0) ; port MISO
MOSI: U17.4(SDI_CFG1) ; port MOSI
REF_Z: R126.1 ; port REF_Z
SCK: U17.3(SCK_CFG2) ; port SCK
Z-DIR: U17.7(DIR) ; port Z-DIR
Z-EN: U17.22(DRV_ENN_CFG6) ; port Z-EN
Z-STEP: U17.6(STEP) ; port Z-STEP
Z_0A1: C62.1 FB6.1 TP71.1 TVS6.K U17.34(OA1)
Z_0A2: C61.1 FB5.1 TP70.1 TVS5.K U17.32(OA2)
Z_0B1: C74.1 FB8.1 TP73.1 TVS8.K U17.13(OB1)
Z_0B2: C64.1 FB7.1 TP72.1 TVS7.K U17.15(OB2)
Z_DIAG: R130.1 U17.20(DIAG0) U17.21(DIAG1) ; port Z_DIAG
Z_nCS: U17.2(CSN_CFG3) ; port Z_nCS
NetC75_2: C75.2 FB5.2 J24.4 J25.4 TP96.1
NetC78_2: C78.2 FB6.2 J24.3 J25.3 TP95.1
NetC79_2: C79.2 FB7.2 J24.2 J25.2 TP94.1
NetC83_2: C83.2 FB8.2 J24.1 J25.1 TP93.1
NetC185_1: C185.1 R126.2 R127.1
NetC186_1: C186.1 R127.2 R128.2 U17.23(AIN_IREF)
NetC188_1: C188.1 C189.2 C190.2 C191.2 FB31.1 U17.16(VS) U17.31(VS)
NetC191_1: C191.1 U17.29(VCP)
NetC192_1: C192.1 U17.28(CPI)
NetC192_2: C192.2 U17.27(CPO)
NetC195_1: C195.1 R129.1 U17.25(5VOUT)
NetC196_2: C196.2 R146.1 U17.33(BRA)
NetC197_2: C197.2 R147.1 U17.14(BRB)

Not connected (* = marked no-connect by the designer): U17 9(DNC)* 10(SPI_MODE)* 17(DCO)* 19(DCIN_CFG5)*

### Notes on the sheet
- X
- Y
- Z
- E1
- E2
- Motor-Z
- J22
- J23
- J24
- J25
- J26
- J27

### Library data of the parts
C61 C62 C64 C74 C75 C78 C79 C83 = CAP 1nF 50V 0402 X7R: as C133-C140 on sheet Motor-Y; VALUE: 1nF; DISTRIBUTOR #: 490-1303-2-ND; DISTRIBUTOR: Digi-Key Electronics; EE_SPEC: 50V
C185 C186 = GRM155R60J105KE19D: as C172 on sheet Motor-Y; VALUE: 1uF; MANUFACTURER #: GRM155R60J105KE19D; DISTRIBUTOR #: 490-1320-2-ND; DISTRIBUTOR: Digi-Key Electronics; TOLERANCE: 10%; EE_SPEC: 1uF 6.3V X5R 0402
C187 C193 C194 = GRM155R71C104KA88D: as C174 on sheet Motor-Y; VALUE: 100nF; MANUFACTURER #: GRM155R71C104KA88D; DISTRIBUTOR #: 490-3261-2-ND; DISTRIBUTOR: Digi-Key Electronics; Tolerance: 10%
C188 = UWT1V101MCL1GS: as C175 on sheet Motor-Y; MANUFACTURER #: UWT1V101MCL1GS; DISTRIBUTOR #: 493-2203-2-ND; DISTRIBUTOR: Digi-Key Electronics; Tolerance: 20%
C189-C191 C196 C197 = C0603C104K5RACTU: as C176-C178 on sheet Motor-Y; VALUE: 100nF; MANUFACTURER #: C0603C104K5RACTU; DISTRIBUTOR #: 399-5089-2-ND; DISTRIBUTOR: Digi-Key Electronics; PART: 100nF 50V X7R 0603; Tolerance: 10%
C192 = GCM155R71H223KA55D: as C179 on sheet Motor-Y; VALUE: 22nF; MANUFACTURER #: GCM155R71H223KA55D; DISTRIBUTOR #: 490-4763-2-ND; DISTRIBUTOR: Digi-Key Electronics; PART: 22nF
C195 = GRM155R60J105KE19D: as C182 on sheet Motor-Y; VALUE: 1uF; MANUFACTURER #: GRM155R60J105KE19D; DISTRIBUTOR #: 490-1320-2-ND; DISTRIBUTOR: Digi-Key Electronics; PART: 1uF 6.3V X5R 0402; Tolerance: 10%
FB5-FB8 = FERRITE 120R 3A 0603: as FB17-FB20 on sheet Motor-Y; DISTRIBUTOR #: 1276-6351-2-ND; DISTRIBUTOR: Digi-Key Electronics; PART: FERRITE 120R 3A 0603; PART DESCRIPTION: FERRITE BEAD 120 OHM 0603 1LN
FB31 = FERRITE 120R 3A 0603: as FB25 on sheet Motor-Y; DISTRIBUTOR #: 1276-6351-2-ND; DISTRIBUTOR: Digi-Key Electronics; PART: FERRITE 120R 3A 0603; PART DESCRIPTION: FERRITE BEAD 120 OHM 0603 1LN
J24 J25 = Molex 0705430003 PIP: as J23 on sheet Motor-Y
R126 R127 = 5.6k 1% 0402: as R117 on sheet Motor-Y; DISTRIBUTOR #: 311-5.6KLRTR-ND; DISTRIBUTOR: Digi-Key Electronics; PART: RES SMD 5.6K OHM 1% 1/16W 0402; TOLERANCE: 1%; EE_SPEC: 1/16W; VALUE: 5.6k
R128 = 10k 1% 0402: as R121 on sheet Motor-Y; DISTRIBUTOR #: YAG1249TR-ND; DISTRIBUTOR: Digi-Key Electronics; PART: 10k 1% 0402; TOLERANCE: 1%; EE_SPEC: 1/16W; VALUE: 10K
R129 = RC0402FR-0710RL: as R122 on sheet Motor-Y; VALUE: 10R; MANUFACTURER #: RC0402FR-0710RL; DISTRIBUTOR #: 311-10.0LRTR-ND; DISTRIBUTOR: Digi-Key Electronics; PART: 10R; Tolerance: 1%
R130 = RC0402FR-0710KP: as R123 on sheet Motor-Y; VALUE: 10K; MANUFACTURER #: RC0402FR-0710KP; DISTRIBUTOR #: YAG1249TR-ND; DISTRIBUTOR: Digi-Key Electronics; TOLERANCE: 1%; EE_SPEC: 1/16W
R146 R147 = 0.12R 1% 1206: as R124 on sheet Motor-Y; DISTRIBUTOR #: 311-.12LYTR-ND; DISTRIBUTOR: Digi-Key; EE_SPEC: 0.12R 1% 1206; PART: 0.12R; VALUE: 0.12R
TP70-TP73 TP93-TP96 = Socket: MANUFACTURER #: NOTAPART-Testpoint
TVS5-TVS8 = TVS 30V SMF: as TVS17 on sheet Motor-Y; DISTRIBUTOR #: SMF30A-E3-08GITR-ND; DISTRIBUTOR: Digi-Key Electronics; PART DESCRIPTION: TVS DIODE 30VWM 48.4VC SMF; TOLERANCE: -NA-
U17 = TMC2130-LA-T: as U16 on sheet Motor-Y; DISTRIBUTOR #: 1460-1130-2-ND; DISTRIBUTOR: Digi-Key Electronics; MANUFACTURER #: TMC2130-LA-T; PART: TMC2130; VALUE: TMC2130

## Sheet Motor-E1.SchDoc: Motor-E1
size Letter; DocumentNumber: 3; SheetNumber: 8; SheetTotal: 11
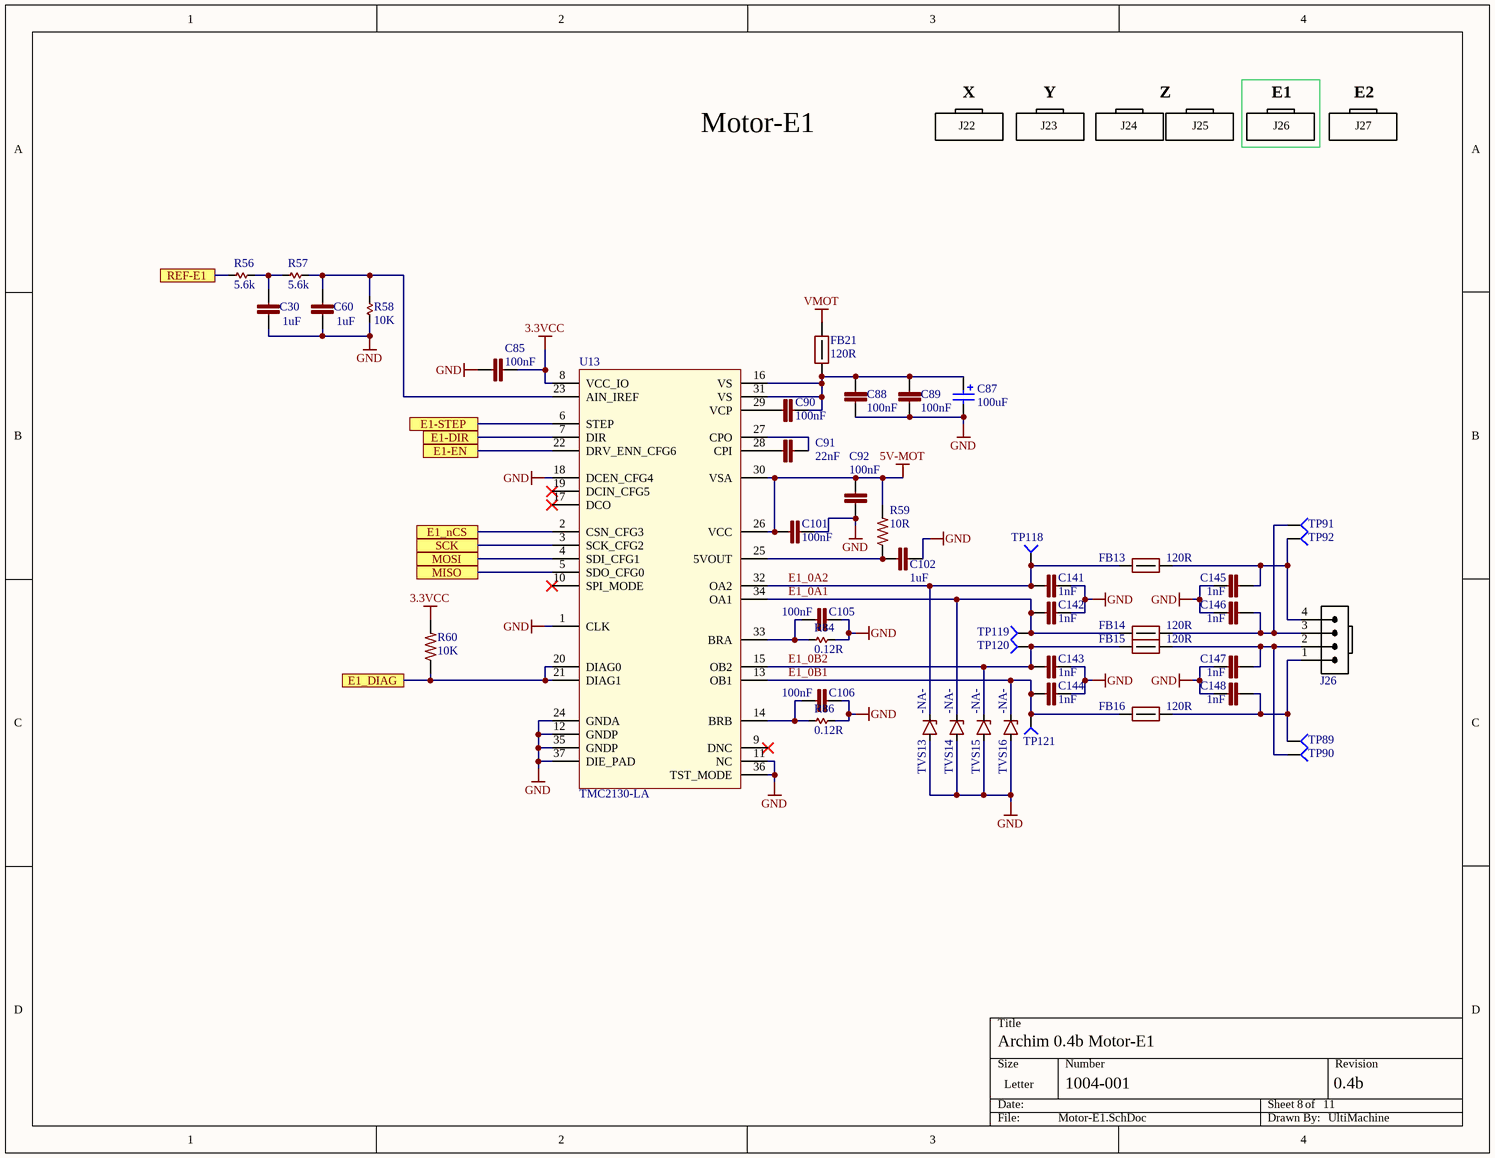
[diagram p7: Motor-E1.SchDoc]

### Parts
C30  1uF  [C0402]
C60  1uF  [C0402]
C85  100nF  [C0402]
C87  value 100uF  [CAP-ELEC-063063077]  (hidden comment: UWT1V101MCL1GS)
C88  100nF  [C0603]
C89  100nF  [C0603]
C90  100nF  [C0603]
C91  22nF  [C0402]
C92  100nF  [C0402]
C101  100nF  [C0402]
C102  1uF  [C0402]
C105  100nF  [C0603]
C106  100nF  [C0603]
C141  1nF  [C0402]
C142  1nF  [C0402]
C143  1nF  [C0402]
C144  1nF  [C0402]
C145  1nF  [C0402]
C146  1nF  [C0402]
C147  1nF  [C0402]
C148  1nF  [C0402]
FB13  120R  [FB0603]
FB14  120R  [FB0603]
FB15  120R  [FB0603]
FB16  120R  [FB0603]
FB21  120R  [FB0603]
J26  Molex 0705430038  [4POL254 PIN-IN-PASTE]  (value not drawn)
R56  5.6k  [R0402]
R57  5.6k  [R0402]
R58  10K  [R0402]
R59  10R  [R0402]
R60  10K  [R0402]
R84  0.12R  [R1206]
R86  0.12R  [R1206]
TP89  TP4  [TP-2]  (value not drawn)  (no BOM)
TP90  TP4  [TP-2]  (value not drawn)  (no BOM)
TP91  TP4  [TP-2]  (value not drawn)  (no BOM)
TP92  TP4  [TP-2]  (value not drawn)  (no BOM)
TP118  TP4  [TP-2]  (value not drawn)  (no BOM)
TP119  TP4  [TP-2]  (value not drawn)  (no BOM)
TP120  TP4  [TP-2]  (value not drawn)  (no BOM)
TP121  TP4  [TP-2]  (value not drawn)  (no BOM)
TVS13  value -NA-  [SMF]  (hidden comment: TVS 30V SMF)
TVS14  value -NA-  [SMF]  (hidden comment: TVS 30V SMF)
TVS15  value -NA-  [SMF]  (hidden comment: TVS 30V SMF)
TVS16  value -NA-  [SMF]  (hidden comment: TVS 30V SMF)
U13  TMC2130-LA  [QFN36-50P500X600X900_HS-37N]

### Ports
E1-DIR, E1-EN, E1-STEP, E1_DIAG, E1_nCS, MISO, MOSI, REF-E1, SCK

### Nets
3.3VCC: C85.1 R60.2 U13.8(VCC_IO)
5V-MOT: C92.2 C101.2 R59.2 U13.26(VCC) U13.30(VSA)
GND: C30.2 C60.2 C85.2 C87.2 C88.1 C89.1 C92.1 C101.1 C102.2 C105.1 C106.1 C141.2 C142.2 C143.2 C144.2 C145.1 C146.1 C147.1 C148.1 R58.1 R84.2 R86.2 TVS13.A TVS14.A TVS15.A TVS16.A U13.1(CLK) U13.11(NC) U13.12(GNDP) U13.18(DCEN_CFG4) U13.24(GNDA) U13.35(GNDP) U13.36(TST_MODE) U13.37(DIE_PAD)
VMOT: FB21.2
E1-DIR: U13.7(DIR) ; port E1-DIR
E1-EN: U13.22(DRV_ENN_CFG6) ; port E1-EN
E1-STEP: U13.6(STEP) ; port E1-STEP
E1_0A1: C142.1 FB14.1 TP119.1 TVS14.K U13.34(OA1)
E1_0A2: C141.1 FB13.1 TP118.1 TVS13.K U13.32(OA2)
E1_0B1: C144.1 FB16.1 TP121.1 TVS16.K U13.13(OB1)
E1_0B2: C143.1 FB15.1 TP120.1 TVS15.K U13.15(OB2)
E1_DIAG: R60.1 U13.20(DIAG0) U13.21(DIAG1) ; port E1_DIAG
E1_nCS: U13.2(CSN_CFG3) ; port E1_nCS
MISO: U13.5(SDO_CFG0) ; port MISO
MOSI: U13.4(SDI_CFG1) ; port MOSI
REF-E1: R56.1 ; port REF-E1
SCK: U13.3(SCK_CFG2) ; port SCK
NetC30_1: C30.1 R56.2 R57.1
NetC60_1: C60.1 R57.2 R58.2 U13.23(AIN_IREF)
NetC87_1: C87.1 C88.2 C89.2 C90.2 FB21.1 U13.16(VS) U13.31(VS)
NetC90_1: C90.1 U13.29(VCP)
NetC91_1: C91.1 U13.28(CPI)
NetC91_2: C91.2 U13.27(CPO)
NetC102_1: C102.1 R59.1 U13.25(5VOUT)
NetC105_2: C105.2 R84.1 U13.33(BRA)
NetC106_2: C106.2 R86.1 U13.14(BRB)
NetC145_2: C145.2 FB13.2 J26.4 TP92.1
NetC146_2: C146.2 FB14.2 J26.3 TP91.1
NetC147_2: C147.2 FB15.2 J26.2 TP90.1
NetC148_2: C148.2 FB16.2 J26.1 TP89.1

Not connected (* = marked no-connect by the designer): U13 9(DNC)* 10(SPI_MODE)* 17(DCO)* 19(DCIN_CFG5)*

### Notes on the sheet
- X
- Y
- Z
- E1
- E2
- Motor-E1
- J22
- J23
- J24
- J25
- J26
- J27

### Library data of the parts
C30 C60 = GRM155R60J105KE19D: as C172 on sheet Motor-Y; VALUE: 1uF; MANUFACTURER #: GRM155R60J105KE19D; DISTRIBUTOR #: 490-1320-2-ND; DISTRIBUTOR: Digi-Key Electronics; TOLERANCE: 10%; EE_SPEC: 1uF 6.3V X5R 0402
C85 C92 C101 = GRM155R71C104KA88D: as C174 on sheet Motor-Y; VALUE: 100nF; MANUFACTURER #: GRM155R71C104KA88D; DISTRIBUTOR #: 490-3261-2-ND; DISTRIBUTOR: Digi-Key Electronics; Tolerance: 10%
C87 = UWT1V101MCL1GS: as C175 on sheet Motor-Y; MANUFACTURER #: UWT1V101MCL1GS; DISTRIBUTOR #: 493-2203-2-ND; DISTRIBUTOR: Digi-Key Electronics; Tolerance: 20%
C88-C90 C105 C106 = C0603C104K5RACTU: as C176-C178 on sheet Motor-Y; VALUE: 100nF; MANUFACTURER #: C0603C104K5RACTU; DISTRIBUTOR #: 399-5089-2-ND; DISTRIBUTOR: Digi-Key Electronics; PART: 100nF 50V X7R 0603; Tolerance: 10%
C91 = GCM155R71H223KA55D: as C179 on sheet Motor-Y; VALUE: 22nF; MANUFACTURER #: GCM155R71H223KA55D; DISTRIBUTOR #: 490-4763-2-ND; DISTRIBUTOR: Digi-Key Electronics; PART: 22nF
C102 = GRM155R60J105KE19D: as C182 on sheet Motor-Y; VALUE: 1uF; MANUFACTURER #: GRM155R60J105KE19D; DISTRIBUTOR #: 490-1320-2-ND; DISTRIBUTOR: Digi-Key Electronics; PART: 1uF 6.3V X5R 0402; Tolerance: 10%
C141-C148 = CAP 1nF 50V 0402 X7R: as C133-C140 on sheet Motor-Y; VALUE: 1nF; DISTRIBUTOR #: 490-1303-2-ND; DISTRIBUTOR: Digi-Key Electronics; EE_SPEC: 50V
FB13-FB16 = FERRITE 120R 3A 0603: as FB17-FB20 on sheet Motor-Y; DISTRIBUTOR #: 1276-6351-2-ND; DISTRIBUTOR: Digi-Key Electronics; PART: FERRITE 120R 3A 0603; PART DESCRIPTION: FERRITE BEAD 120 OHM 0603 1LN
FB21 = FERRITE 120R 3A 0603: as FB25 on sheet Motor-Y; DISTRIBUTOR #: 1276-6351-2-ND; DISTRIBUTOR: Digi-Key Electronics; PART: FERRITE 120R 3A 0603; PART DESCRIPTION: FERRITE BEAD 120 OHM 0603 1LN
J26 = Molex 0705430003 PIP: as J23 on sheet Motor-Y
R56 R57 = 5.6k 1% 0402: as R117 on sheet Motor-Y; DISTRIBUTOR #: 311-5.6KLRTR-ND; DISTRIBUTOR: Digi-Key Electronics; PART: RES SMD 5.6K OHM 1% 1/16W 0402; TOLERANCE: 1%; EE_SPEC: 1/16W; VALUE: 5.6k
R58 = 10k 1% 0402: as R121 on sheet Motor-Y; DISTRIBUTOR #: YAG1249TR-ND; DISTRIBUTOR: Digi-Key Electronics; PART: 10k 1% 0402; TOLERANCE: 1%; EE_SPEC: 1/16W; VALUE: 10K
R59 = RC0402FR-0710RL: as R122 on sheet Motor-Y; VALUE: 10R; MANUFACTURER #: RC0402FR-0710RL; DISTRIBUTOR #: 311-10.0LRTR-ND; DISTRIBUTOR: Digi-Key Electronics; PART: 10R; Tolerance: 1%
R60 = RC0402FR-0710KP: as R123 on sheet Motor-Y; VALUE: 10K; MANUFACTURER #: RC0402FR-0710KP; DISTRIBUTOR #: YAG1249TR-ND; DISTRIBUTOR: Digi-Key Electronics; TOLERANCE: 1%; EE_SPEC: 1/16W
R84 R86 = 0.12R 1% 1206: as R124 on sheet Motor-Y; DISTRIBUTOR #: 311-.12LYTR-ND; DISTRIBUTOR: Digi-Key; EE_SPEC: 0.12R 1% 1206; PART: 0.12R; VALUE: 0.12R
TP89-TP92 TP118-TP121 = Socket: MANUFACTURER #: NOTAPART-Testpoint
TVS13-TVS16 = TVS 30V SMF: as TVS17 on sheet Motor-Y; DISTRIBUTOR #: SMF30A-E3-08GITR-ND; DISTRIBUTOR: Digi-Key Electronics; PART DESCRIPTION: TVS DIODE 30VWM 48.4VC SMF; TOLERANCE: -NA-
U13 = TMC2130-LA-T: as U16 on sheet Motor-Y; DISTRIBUTOR #: 1460-1130-2-ND; DISTRIBUTOR: Digi-Key Electronics; MANUFACTURER #: TMC2130-LA-T; PART: TMC2130; VALUE: TMC2130

## Sheet Motor-E2.SchDoc: Motor-E2
size Letter; DocumentNumber: 3; SheetNumber: 9; SheetTotal: 11
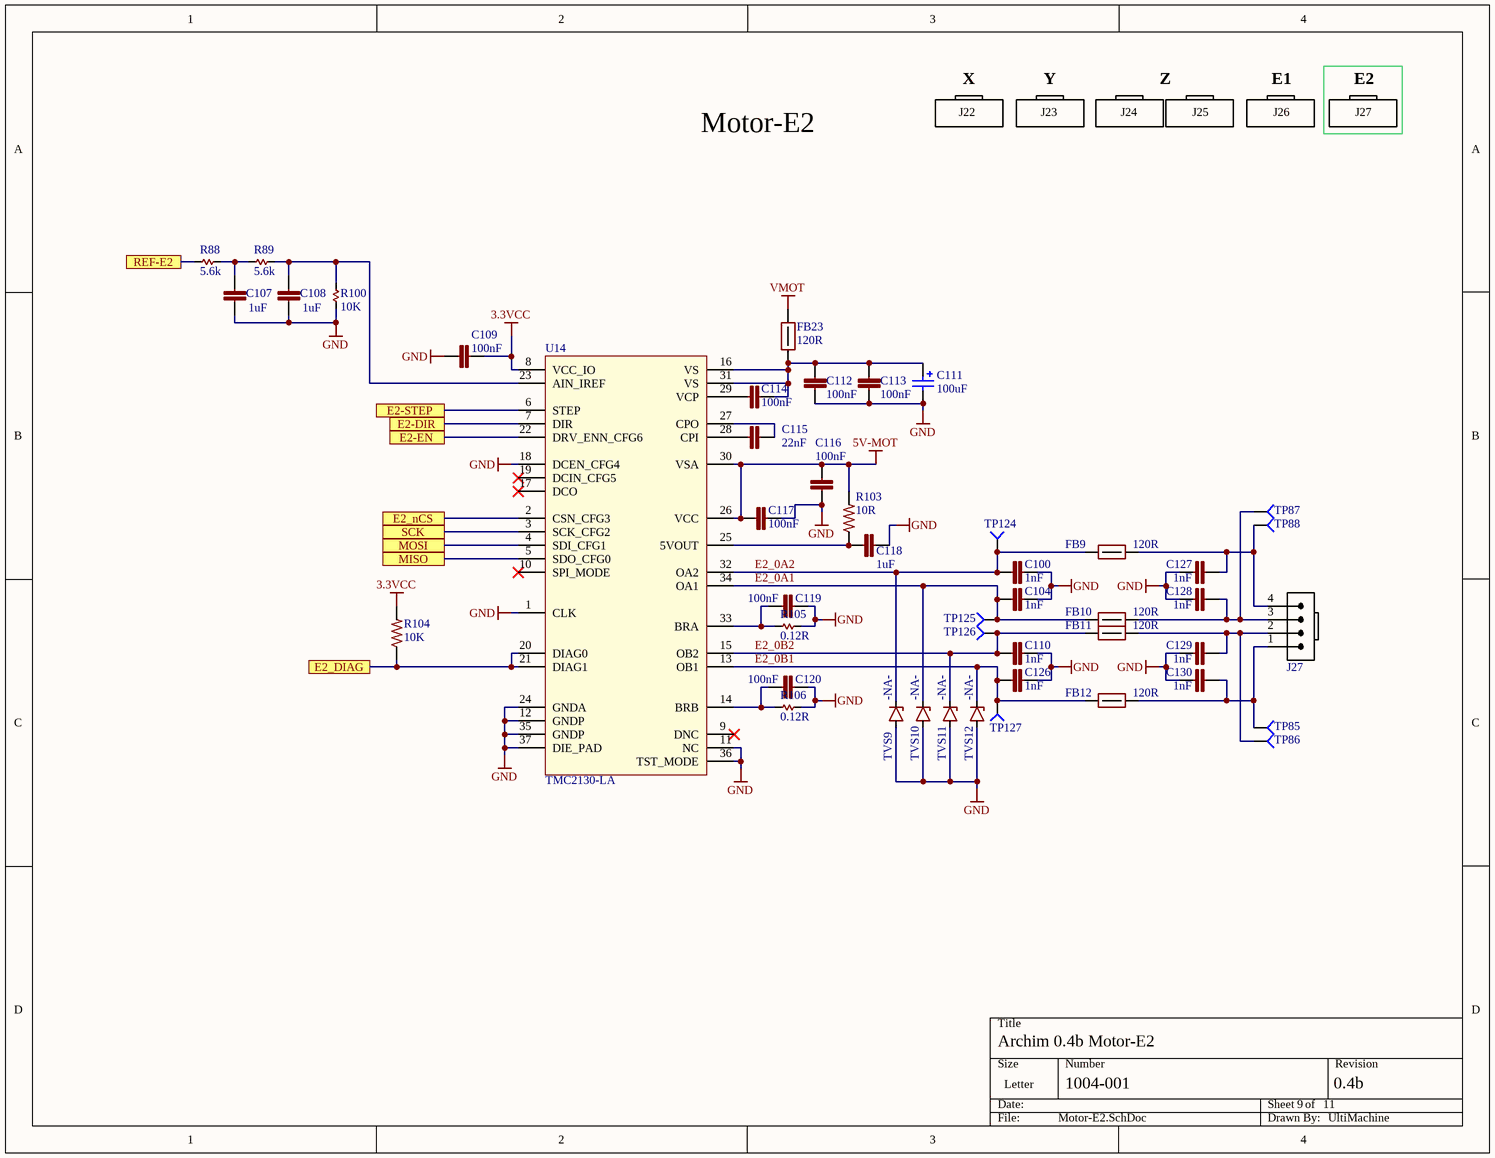
[diagram p8: Motor-E2.SchDoc]

### Parts
C100  1nF  [C0402]
C104  1nF  [C0402]
C107  1uF  [C0402]
C108  1uF  [C0402]
C109  100nF  [C0402]
C110  1nF  [C0402]
C111  value 100uF  [CAP-ELEC-063063077]  (hidden comment: UWT1V101MCL1GS)
C112  100nF  [C0603]
C113  100nF  [C0603]
C114  100nF  [C0603]
C115  22nF  [C0402]
C116  100nF  [C0402]
C117  100nF  [C0402]
C118  1uF  [C0402]
C119  100nF  [C0603]
C120  100nF  [C0603]
C126  1nF  [C0402]
C127  1nF  [C0402]
C128  1nF  [C0402]
C129  1nF  [C0402]
C130  1nF  [C0402]
FB9  120R  [FB0603]
FB10  120R  [FB0603]
FB11  120R  [FB0603]
FB12  120R  [FB0603]
FB23  120R  [FB0603]
J27  Molex 0705430038  [4POL254 PIN-IN-PASTE]  (value not drawn)
R88  5.6k  [R0402]
R89  5.6k  [R0402]
R100  10K  [R0402]
R103  10R  [R0402]
R104  10K  [R0402]
R105  0.12R  [R1206]
R106  0.12R  [R1206]
TP85  TP4  [TP-2]  (value not drawn)  (no BOM)
TP86  TP4  [TP-2]  (value not drawn)  (no BOM)
TP87  TP4  [TP-2]  (value not drawn)  (no BOM)
TP88  TP4  [TP-2]  (value not drawn)  (no BOM)
TP124  TP4  [TP-2]  (value not drawn)  (no BOM)
TP125  TP4  [TP-2]  (value not drawn)  (no BOM)
TP126  TP4  [TP-2]  (value not drawn)  (no BOM)
TP127  TP4  [TP-2]  (value not drawn)  (no BOM)
TVS9  value -NA-  [SMF]  (hidden comment: TVS 30V SMF)
TVS10  value -NA-  [SMF]  (hidden comment: TVS 30V SMF)
TVS11  value -NA-  [SMF]  (hidden comment: TVS 30V SMF)
TVS12  value -NA-  [SMF]  (hidden comment: TVS 30V SMF)
U14  TMC2130-LA  [QFN36-50P500X600X900_HS-37N]

### Ports
E2-DIR, E2-EN, E2-STEP, E2_DIAG, E2_nCS, MISO, MOSI, REF-E2, SCK

### Nets
3.3VCC: C109.1 R104.2 U14.8(VCC_IO)
5V-MOT: C116.2 C117.2 R103.2 U14.26(VCC) U14.30(VSA)
GND: C100.2 C104.2 C107.2 C108.2 C109.2 C110.2 C111.2 C112.1 C113.1 C116.1 C117.1 C118.2 C119.1 C120.1 C126.2 C127.1 C128.1 C129.1 C130.1 R100.1 R105.2 R106.2 TVS9.A TVS10.A TVS11.A TVS12.A U14.1(CLK) U14.11(NC) U14.12(GNDP) U14.18(DCEN_CFG4) U14.24(GNDA) U14.35(GNDP) U14.36(TST_MODE) U14.37(DIE_PAD)
VMOT: FB23.2
E2-DIR: U14.7(DIR) ; port E2-DIR
E2-EN: U14.22(DRV_ENN_CFG6) ; port E2-EN
E2-STEP: U14.6(STEP) ; port E2-STEP
E2_0A1: C104.1 FB10.1 TP125.1 TVS10.K U14.34(OA1)
E2_0A2: C100.1 FB9.1 TP124.1 TVS9.K U14.32(OA2)
E2_0B1: C126.1 FB12.1 TP127.1 TVS12.K U14.13(OB1)
E2_0B2: C110.1 FB11.1 TP126.1 TVS11.K U14.15(OB2)
E2_DIAG: R104.1 U14.20(DIAG0) U14.21(DIAG1) ; port E2_DIAG
E2_nCS: U14.2(CSN_CFG3) ; port E2_nCS
MISO: U14.5(SDO_CFG0) ; port MISO
MOSI: U14.4(SDI_CFG1) ; port MOSI
REF-E2: R88.1 ; port REF-E2
SCK: U14.3(SCK_CFG2) ; port SCK
NetC107_1: C107.1 R88.2 R89.1
NetC108_1: C108.1 R89.2 R100.2 U14.23(AIN_IREF)
NetC111_1: C111.1 C112.2 C113.2 C114.2 FB23.1 U14.16(VS) U14.31(VS)
NetC114_1: C114.1 U14.29(VCP)
NetC115_1: C115.1 U14.28(CPI)
NetC115_2: C115.2 U14.27(CPO)
NetC118_1: C118.1 R103.1 U14.25(5VOUT)
NetC119_2: C119.2 R105.1 U14.33(BRA)
NetC120_2: C120.2 R106.1 U14.14(BRB)
NetC127_2: C127.2 FB9.2 J27.4 TP88.1
NetC128_2: C128.2 FB10.2 J27.3 TP87.1
NetC129_2: C129.2 FB11.2 J27.2 TP86.1
NetC130_2: C130.2 FB12.2 J27.1 TP85.1

Not connected (* = marked no-connect by the designer): U14 9(DNC)* 10(SPI_MODE)* 17(DCO)* 19(DCIN_CFG5)*

### Notes on the sheet
- X
- Y
- Z
- E1
- E2
- Motor-E2
- J22
- J23
- J24
- J25
- J26
- J27

### Library data of the parts
C100 C104 C110 C126-C130 = CAP 1nF 50V 0402 X7R: as C133-C140 on sheet Motor-Y; VALUE: 1nF; DISTRIBUTOR #: 490-1303-2-ND; DISTRIBUTOR: Digi-Key Electronics; EE_SPEC: 50V
C107 C108 = GRM155R60J105KE19D: as C172 on sheet Motor-Y; VALUE: 1uF; MANUFACTURER #: GRM155R60J105KE19D; DISTRIBUTOR #: 490-1320-2-ND; DISTRIBUTOR: Digi-Key Electronics; TOLERANCE: 10%; EE_SPEC: 1uF 6.3V X5R 0402
C109 C116 C117 = GRM155R71C104KA88D: as C174 on sheet Motor-Y; VALUE: 100nF; MANUFACTURER #: GRM155R71C104KA88D; DISTRIBUTOR #: 490-3261-2-ND; DISTRIBUTOR: Digi-Key Electronics; Tolerance: 10%
C111 = UWT1V101MCL1GS: as C175 on sheet Motor-Y; MANUFACTURER #: UWT1V101MCL1GS; DISTRIBUTOR #: 493-2203-2-ND; DISTRIBUTOR: Digi-Key Electronics; Tolerance: 20%
C112-C114 C119 C120 = C0603C104K5RACTU: as C176-C178 on sheet Motor-Y; VALUE: 100nF; MANUFACTURER #: C0603C104K5RACTU; DISTRIBUTOR #: 399-5089-2-ND; DISTRIBUTOR: Digi-Key Electronics; PART: 100nF 50V X7R 0603; Tolerance: 10%
C115 = GCM155R71H223KA55D: as C179 on sheet Motor-Y; VALUE: 22nF; MANUFACTURER #: GCM155R71H223KA55D; DISTRIBUTOR #: 490-4763-2-ND; DISTRIBUTOR: Digi-Key Electronics; PART: 22nF
C118 = GRM155R60J105KE19D: as C182 on sheet Motor-Y; VALUE: 1uF; MANUFACTURER #: GRM155R60J105KE19D; DISTRIBUTOR #: 490-1320-2-ND; DISTRIBUTOR: Digi-Key Electronics; PART: 1uF 6.3V X5R 0402; Tolerance: 10%
FB9-FB12 = FERRITE 120R 3A 0603: as FB17-FB20 on sheet Motor-Y; DISTRIBUTOR #: 1276-6351-2-ND; DISTRIBUTOR: Digi-Key Electronics; PART: FERRITE 120R 3A 0603; PART DESCRIPTION: FERRITE BEAD 120 OHM 0603 1LN
FB23 = FERRITE 120R 3A 0603: as FB25 on sheet Motor-Y; DISTRIBUTOR #: 1276-6351-2-ND; DISTRIBUTOR: Digi-Key Electronics; PART: FERRITE 120R 3A 0603; PART DESCRIPTION: FERRITE BEAD 120 OHM 0603 1LN
J27 = Molex 0705430003 PIP: as J23 on sheet Motor-Y
R88 R89 = 5.6k 1% 0402: as R117 on sheet Motor-Y; DISTRIBUTOR #: 311-5.6KLRTR-ND; DISTRIBUTOR: Digi-Key Electronics; PART: RES SMD 5.6K OHM 1% 1/16W 0402; TOLERANCE: 1%; EE_SPEC: 1/16W; VALUE: 5.6k
R100 = 10k 1% 0402: as R121 on sheet Motor-Y; DISTRIBUTOR #: YAG1249TR-ND; DISTRIBUTOR: Digi-Key Electronics; PART: 10k 1% 0402; TOLERANCE: 1%; EE_SPEC: 1/16W; VALUE: 10K
R103 = RC0402FR-0710RL: as R122 on sheet Motor-Y; VALUE: 10R; MANUFACTURER #: RC0402FR-0710RL; DISTRIBUTOR #: 311-10.0LRTR-ND; DISTRIBUTOR: Digi-Key Electronics; PART: 10R; Tolerance: 1%
R104 = RC0402FR-0710KP: as R123 on sheet Motor-Y; VALUE: 10K; MANUFACTURER #: RC0402FR-0710KP; DISTRIBUTOR #: YAG1249TR-ND; DISTRIBUTOR: Digi-Key Electronics; TOLERANCE: 1%; EE_SPEC: 1/16W
R105 R106 = 0.12R 1% 1206: as R124 on sheet Motor-Y; DISTRIBUTOR #: 311-.12LYTR-ND; DISTRIBUTOR: Digi-Key; EE_SPEC: 0.12R 1% 1206; PART: 0.12R; VALUE: 0.12R
TP85-TP88 TP124-TP127 = Socket: MANUFACTURER #: NOTAPART-Testpoint
TVS9-TVS12 = TVS 30V SMF: as TVS17 on sheet Motor-Y; DISTRIBUTOR #: SMF30A-E3-08GITR-ND; DISTRIBUTOR: Digi-Key Electronics; PART DESCRIPTION: TVS DIODE 30VWM 48.4VC SMF; TOLERANCE: -NA-
U14 = TMC2130-LA-T: as U16 on sheet Motor-Y; DISTRIBUTOR #: 1460-1130-2-ND; DISTRIBUTOR: Digi-Key Electronics; MANUFACTURER #: TMC2130-LA-T; PART: TMC2130; VALUE: TMC2130

## Sheet Thermistors.SchDoc: Thermistors
size Letter; DocumentNumber: 6; SheetNumber: 10; SheetTotal: 11
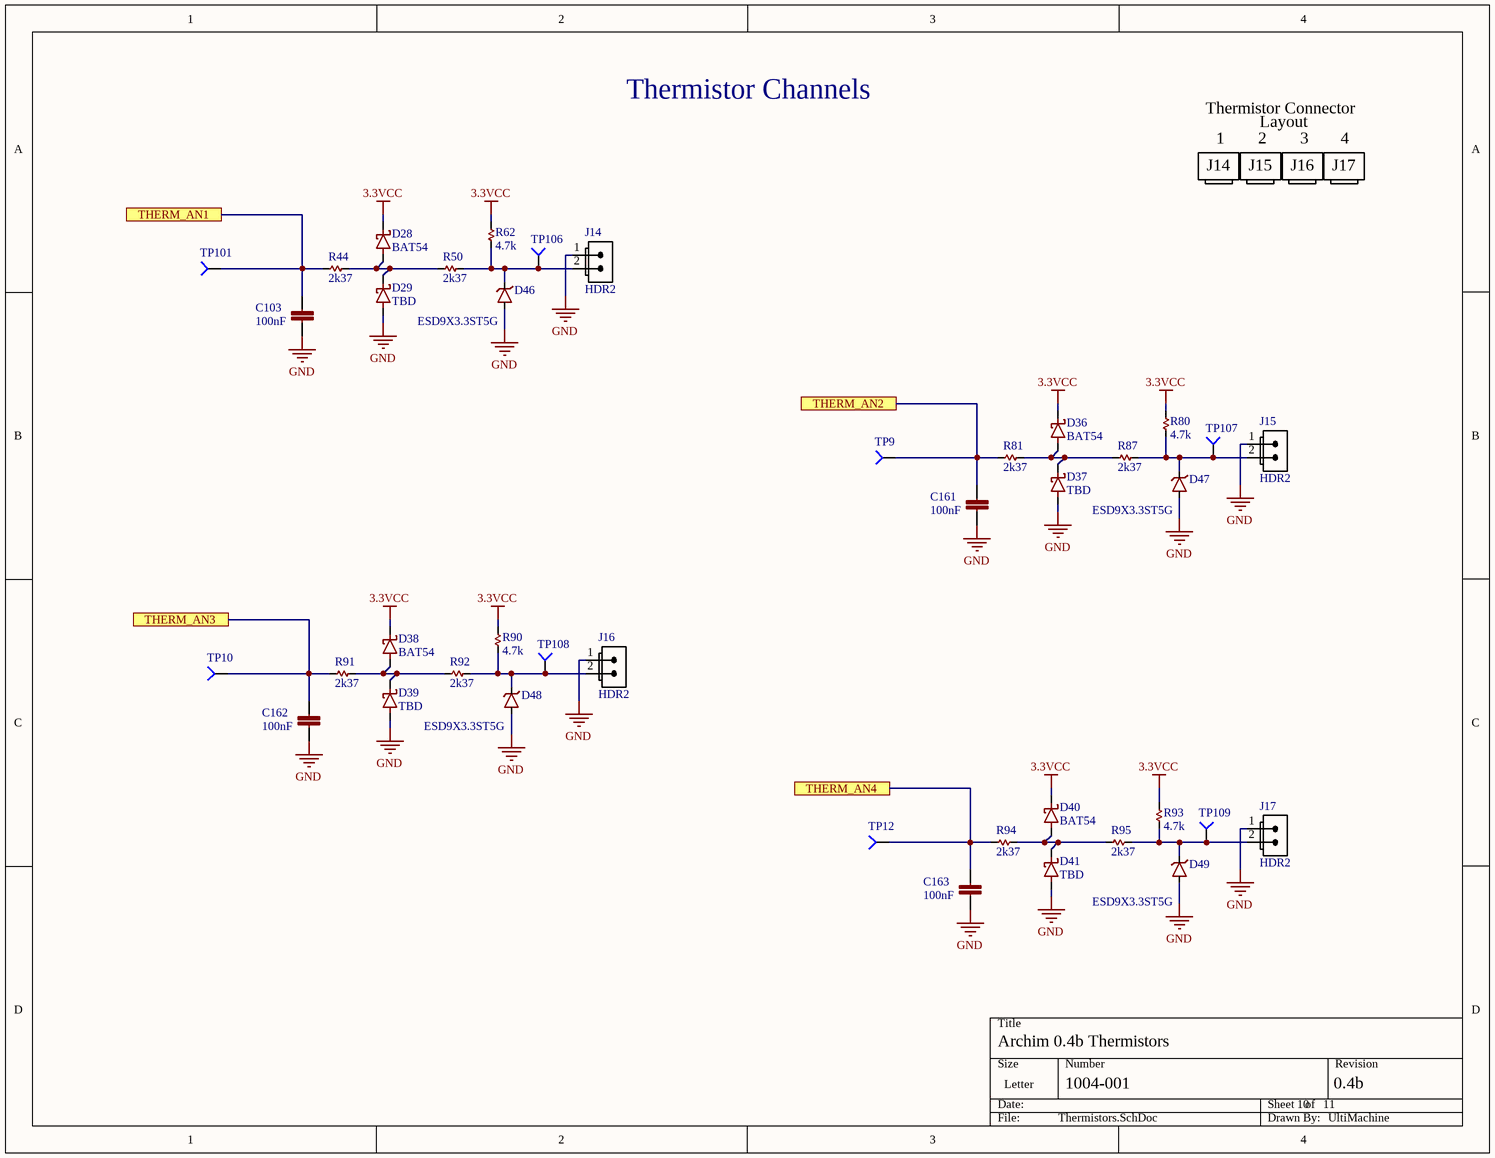
[diagram p9: Thermistors.SchDoc]

### Parts
C103  100nF  [C0402]
C161  100nF  [C0402]
C162  100nF  [C0402]
C163  100nF  [C0402]
D28  BAT54  [SOD523_IPC]
D29  TBD  [SOD523_IPC]
D36  BAT54  [SOD523_IPC]
D37  TBD  [SOD523_IPC]
D38  BAT54  [SOD523_IPC]
D39  TBD  [SOD523_IPC]
D40  BAT54  [SOD523_IPC]
D41  TBD  [SOD523_IPC]
D46  ESD9X3.3ST5G  [SOD923-D]
D47  ESD9X3.3ST5G  [SOD923-D]
D48  ESD9X3.3ST5G  [SOD923-D]
D49  ESD9X3.3ST5G  [SOD923-D]
J14  value HDR2  [70543-01 PIN-IN-PASTE]  (hidden comment: CONN 2PIN VERT 0.1" SHRD LOCKING PIP)
J15  value HDR2  [70543-01 PIN-IN-PASTE]  (hidden comment: CONN 2PIN VERT 0.1" SHRD LOCKING PIP)
J16  value HDR2  [70543-01 PIN-IN-PASTE]  (hidden comment: CONN 2PIN VERT 0.1" SHRD LOCKING PIP)
J17  value HDR2  [70543-01 PIN-IN-PASTE]  (hidden comment: CONN 2PIN VERT 0.1" SHRD LOCKING PIP)
R44  2k37  [R0402]
R50  2k37  [R0402]
R62  4.7k  [R0402]
R80  4.7k  [R0402]
R81  2k37  [R0402]
R87  2k37  [R0402]
R90  4.7k  [R0402]
R91  2k37  [R0402]
R92  2k37  [R0402]
R93  4.7k  [R0402]
R94  2k37  [R0402]
R95  2k37  [R0402]
TP9  TP4  [TP-2]  (value not drawn)  (no BOM)
TP10  TP4  [TP-2]  (value not drawn)  (no BOM)
TP12  TP4  [TP-2]  (value not drawn)  (no BOM)
TP101  TP4  [TP-2]  (value not drawn)  (no BOM)
TP106  TP4  [TP-2]  (value not drawn)  (no BOM)
TP107  TP4  [TP-2]  (value not drawn)  (no BOM)
TP108  TP4  [TP-2]  (value not drawn)  (no BOM)
TP109  TP4  [TP-2]  (value not drawn)  (no BOM)

### Ports
THERM_AN1, THERM_AN2, THERM_AN3, THERM_AN4

### Nets
3.3VCC: D28.K D36.K D38.K D40.K R62.2 R80.2 R90.2 R93.2
GND: C103.2 C161.2 C162.2 C163.2 D29.A D37.A D39.A D41.A D46.A D47.A D48.A D49.A J14.1(S) J15.1(S) J16.1(S) J17.1(S)
THERM_AN1: C103.1 R44.1 TP101.1 ; port THERM_AN1
THERM_AN2: C161.1 R81.1 TP9.1 ; port THERM_AN2
THERM_AN3: C162.1 R91.1 TP10.1 ; port THERM_AN3
THERM_AN4: C163.1 R94.1 TP12.1 ; port THERM_AN4
NetD28_A: D28.A D29.K R44.2 R50.1
NetD36_A: D36.A D37.K R81.2 R87.1
NetD38_A: D38.A D39.K R91.2 R92.1
NetD40_A: D40.A D41.K R94.2 R95.1
NetD46_K: D46.K J14.2(S) R50.2 R62.1 TP106.1
NetD47_K: D47.K J15.2(S) R80.1 R87.2 TP107.1
NetD48_K: D48.K J16.2(S) R90.1 R92.2 TP108.1
NetD49_K: D49.K J17.2(S) R93.1 R95.2 TP109.1

### Notes on the sheet
- Thermistor Channels
- Thermistor Connector
- 1
- 2
- Layout
- 3
- 4
- J14
- J15
- J16
- J17

### Library data of the parts
C103 C161-C163 = GRM155R71C104KA88D: CAP CER 0402 100nF 16V 10% X7R; MANUFACTURER: Murata; PART: 0.1uF 16V X7R 0402; PART DESCRIPTION: 0.10µF ±10% 16V Ceramic Capacitor X7R 0402 (1005 Metric); EE_SPEC: 100nF 16V X7R 0402; VALUE: 100nF; MANUFACTURER #: GRM155R71C104KA88D; DISTRIBUTOR #: 490-3261-2-ND; DISTRIBUTOR: Digi-Key Electronics; TOLERANCE: 10%
D28 D36 D38 D40 = BAT54WX: DIODE SCHOTTKY 30V 200MA SOD523; MANUFACTURER: Diodes Incorporated; MANUFACTURER #: BAT54WX-TP; PART: Schottky Diode; PART DESCRIPTION: Diode Schottky 30V 200mA (DC) Surface Mount SOD-523; TOLERANCE: -NA-; VALUE: BAT54; DISTRIBUTOR #: BAT54WX-TPTR-ND; DISTRIBUTOR: Digi-Key Electronics; EE_SPEC: 30V 200mA
D29 D37 D39 D41 = SOD523_TBD: TOLERANCE: -NA-; MANUFACTURER: TBD; VALUE: TBD; MANUFACTURER #: TBD; EE_SPEC: TBD
D46-D49 = ESD9X3.3ST5G: TVS DIODE 3.3VWM 10.4VC SOD923; MANUFACTURER: On Semi; PART DESCRIPTION: TVS DIODE 3.3VWM SOD923; TOLERANCE: -NA-; VALUE: 3.3V; EE_SPEC: 3.3Vso 15pF; MANUFACTURER #: ESD9X3.3ST5G; DISTRIBUTOR #: ESD9X3.3ST5GOSCT-ND; DISTRIBUTOR: Digikey
J14-J17 = CONN 2PIN VERT 0.1" SHRD LOCKING PIP: Connector 2pos - Pin in Paste; MANUFACTURER: Molex; MANUFACTURER #: 0705430001; PART: 2 Pin Conn; PART DESCRIPTION: 2 Positions Header, Shrouded Connector 0.100" (2.54mm) Through Hole Gold; TOLERANCE: -NA-; DISTRIBUTOR #: WM4800-ND; DISTRIBUTOR: Digikey; EE_SPEC: -NA-
R44 R50 R81 R87 R91 R92 R94 R95 = RC0402FR-072K37L: RES SMD 2.37K OHM 1% 1/16W 0402; MANUFACTURER: Yageo; PART: 2.37k 1% 0402; PART DESCRIPTION: 2.37k Ohm ±1% 0.063W, 1/16W Chip Resistor 0402 (1005 Metric) Moisture Resistant Thick Film; VALUE: 2k37; MANUFACTURER #: RC0402FR-072K37L; DISTRIBUTOR #: 311-2.37KLRTR-ND; DISTRIBUTOR: Digi-Key Electronics; TOLERANCE: 1%; EE_SPEC: 1/16W
R62 R80 R90 R93 = RC0402FR-074K7L: RES SMD 4.7K OHM 1% 1/16W 0402; MANUFACTURER: YAGEO; PART: 4.7k 1% 0402; PART DESCRIPTION: 4.7k Ohm ±1% 0.063W, 1/16W Chip Resistor 0402 (1005 Metric) Moisture Resistant Thick Film; VALUE: 4.7k; MANUFACTURER #: RC0402FR-074K7L; DISTRIBUTOR #: 311-4.7KLRTR-ND; DISTRIBUTOR: Digi-Key Electronics; TOLERANCE: 1%; EE_SPEC: 1/16W
TP9 TP10 TP12 TP101 TP106-TP109 = Socket: MANUFACTURER #: NOTAPART-Testpoint